# Altium project POWER CARD.PrjPcb
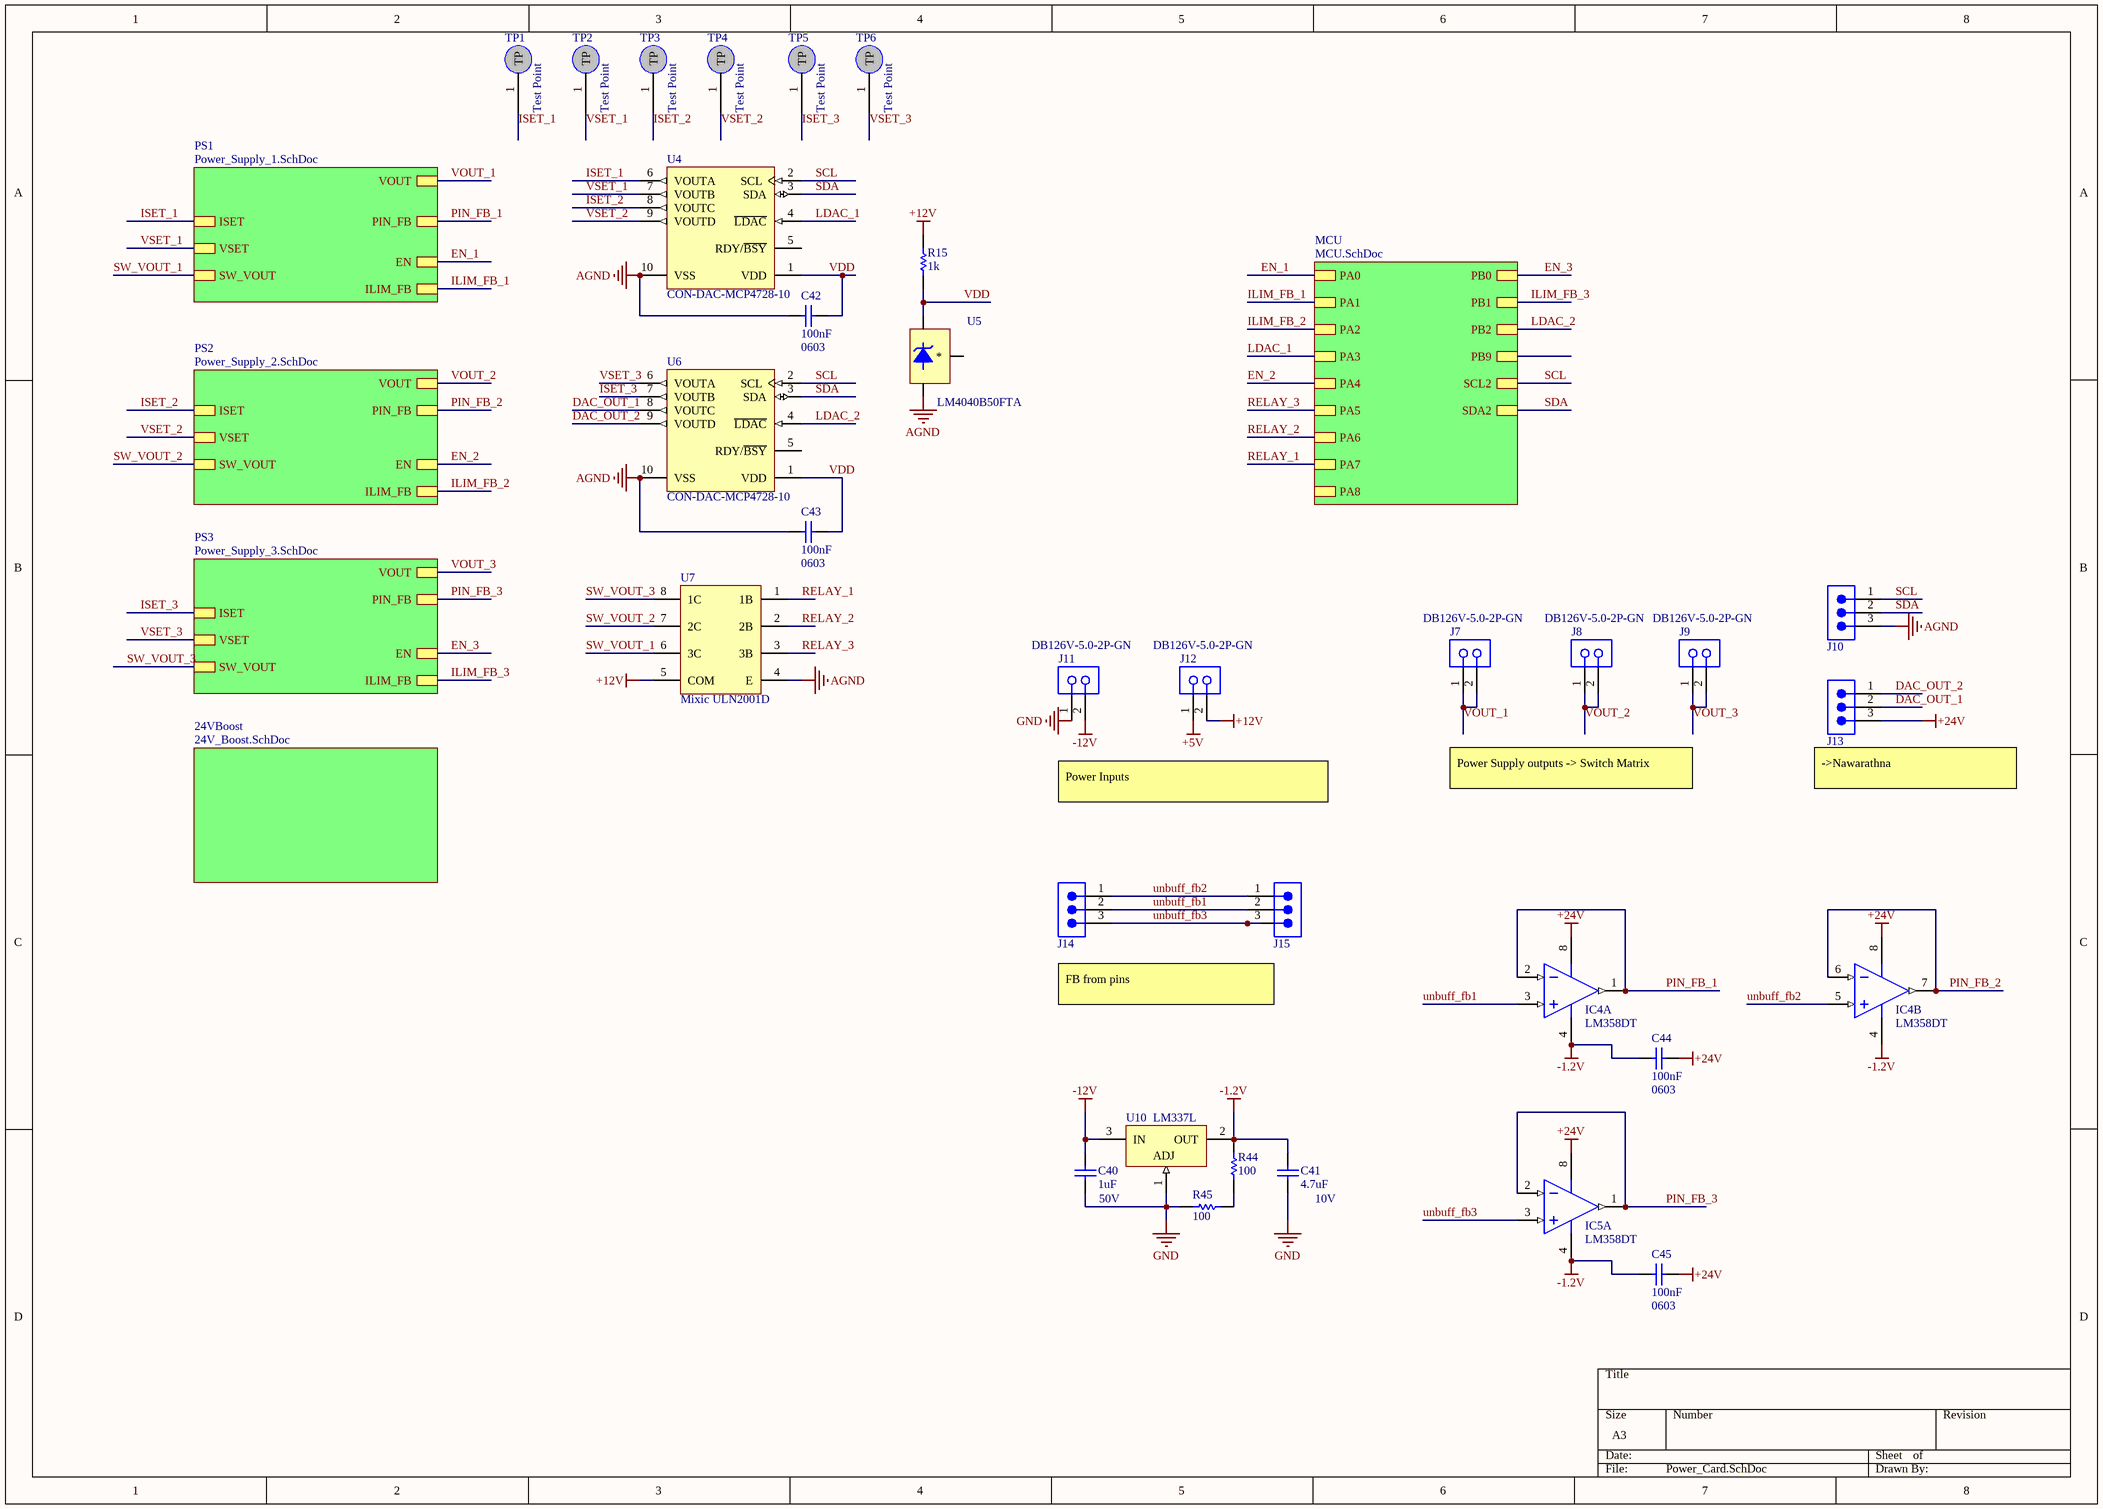
[diagram p0: Power_Card.SchDoc]
7 sheets, 178 parts. Net scope: hierarchical (ports join the sheet entries above them; power ports are global).
Board file: Power_Card_Lahiru.PcbDoc
Sheets:
  Power_Card.SchDoc
    PS1 = Power_Supply_1.SchDoc
      L1 = Power_Supply_Current_Limit.SchDoc
    PS2 = Power_Supply_2.SchDoc
      L2 = Power_Supply_Current_Limit.SchDoc
    PS3 = Power_Supply_3.SchDoc
      L3 = Power_Supply_Current_Limit.SchDoc
    24VBoost = 24V_Boost.SchDoc
    MCU = MCU.SchDoc

## Sheet Power_Card.SchDoc
size A3

### Parts
C40  1uF  Voltage-Rated: 50V  [CAPC1608X09N]
C41  4.7uF  Voltage-Rated: 10V  [CAPC1608X09N]
C42  100nF  Package / Case: 0603  [CAPC1608X09N]
C43  100nF  Package / Case: 0603  [CAPC1608X09N]
C44  100nF  Package / Case: 0603  [CAPC1608X09N]
C45  100nF  Package / Case: 0603  [CAPC1608X09N]
IC4  LM358DT  [SOIC-OA8_M]  (parts A,B of 2)
IC5  LM358DT  [SOIC-OA8_M]  (part A of 2)
J7  DB126V-5.0-2P-GN  [PCB-kiok1jlp9o9fcwf1wwvf-1]
J8  DB126V-5.0-2P-GN  [PCB-kiok1jlp9o9fcwf1wwvf-1]
J9  DB126V-5.0-2P-GN  [PCB-kiok1jlp9o9fcwf1wwvf-1]
J10  M20-9990346  [PIN_3x1_STR (2.54mm)]  (value not drawn)
J11  DB126V-5.0-2P-GN  [PCB-kiok1jlp9o9fcwf1wwvf-1]
J12  DB126V-5.0-2P-GN  [PCB-kiok1jlp9o9fcwf1wwvf-1]
J13  M20-9990346  [PIN_3x1_STR (2.54mm)]  (value not drawn)
J14  M20-9990346  [PIN_3x1_STR (2.54mm)]  (value not drawn)
J15  M20-9990346  [PIN_3x1_STR (2.54mm)]  (value not drawn)
R15  1k  [gen0603-2]
R44  100  [gen0603-2]
R45  100  [gen0603-2]
TP1  Test Point  [PCB-76sf9akqozhr8i1vmz2c-1]
TP2  Test Point  [PCB-76sf9akqozhr8i1vmz2c-1]
TP3  Test Point  [PCB-76sf9akqozhr8i1vmz2c-1]
TP4  Test Point  [PCB-76sf9akqozhr8i1vmz2c-1]
TP5  Test Point  [PCB-76sf9akqozhr8i1vmz2c-1]
TP6  Test Point  [PCB-76sf9akqozhr8i1vmz2c-1]
U4  CON-DAC-MCP4728-10  [PCB-psrfqusngns6snaz1e8o-1]
U5  LM4040B50FTA  [PCB-bxhnyzncanvi69437o7v-1]
U6  CON-DAC-MCP4728-10  [PCB-psrfqusngns6snaz1e8o-1]
U7  Mixic ULN2001D  [PCB-pxs93rufbf6wijgtyo7d-1]
U10  LM337L  [Z03A]

### Sub-sheets
24VBoost = 24V_Boost.SchDoc: no entries
MCU = MCU.SchDoc: PA1, PA8, PB2, PB9, PA7, PA6, PA4, PA2, PA5, PA3, SDA2, PB0, PB1, SCL2, PA0
PS1 = Power_Supply_1.SchDoc: EN, VSET, VOUT, ISET, SW_VOUT, ILIM_FB, PIN_FB
PS2 = Power_Supply_2.SchDoc: VSET, EN, SW_VOUT, VOUT, ISET, ILIM_FB, PIN_FB
PS3 = Power_Supply_3.SchDoc: VSET, EN, SW_VOUT, VOUT, ISET, ILIM_FB, PIN_FB

### Nets
+5V: J12.1
+12V: J12.2 R15.2 U7.5(COM)
+24V: C44.2 C45.2 IC4.8(VCC) IC5.8(VCC) J13.3
-1.2V: C41.2 C44.1 C45.1 IC4.4(VEE/GND) IC5.4(VEE/GND) R44.1 U10.2(OUT)
-12V: C40.2 J11.2 U10.3(IN)
AGND: C42.2 C43.1 J10.3 U4.10(VSS) U5.2(-V) U6.10(VSS) U7.4(E)
GND: C40.1 C41.1 J11.1 R45.2 U10.1(ADJ)
DAC_OUT_1: J13.2 U6.8(VOUTC)
DAC_OUT_2: J13.1 U6.9(VOUTD)
EN_1: sheet PS1/EN, sheet MCU/PA0
EN_2: sheet PS2/EN, sheet MCU/PA4
EN_3: sheet PS3/EN, sheet MCU/PB0
ILIM_FB_1: sheet PS1/ILIM_FB, sheet MCU/PA1
ILIM_FB_2: sheet PS2/ILIM_FB, sheet MCU/PA2
ILIM_FB_3: sheet PS3/ILIM_FB, sheet MCU/PB1
ISET_1: TP1.1(TP) U4.6(VOUTA) ; sheet PS1/ISET
ISET_2: TP3.1(TP) U4.8(VOUTC) ; sheet PS2/ISET
ISET_3: TP5.1(TP) U6.7(VOUTB) ; sheet PS3/ISET
LDAC_1: U4.4(~{LDAC}) ; sheet MCU/PA3
LDAC_2: U6.4(~{LDAC}) ; sheet MCU/PB2  [project net BOOT1]
PIN_FB_1: IC4.1(OUTA) IC4.2(INA-) ; sheet PS1/PIN_FB  [project net FB1]
PIN_FB_2: IC4.6(INB-) IC4.7(OUTB) ; sheet PS2/PIN_FB  [project net FB2]
PIN_FB_3: IC5.1(OUTA) IC5.2(INA-) ; sheet PS3/PIN_FB  [project net FB3]
RELAY_1: U7.1(1B) ; sheet MCU/PA7
RELAY_2: U7.2(2B) ; sheet MCU/PA6
RELAY_3: U7.3(3B) ; sheet MCU/PA5
SCL: J10.1 U4.2(SCL) U6.2(SCL) ; sheet MCU/SCL2  [project net PB10]
SDA: J10.2 U4.3(SDA) U6.3(SDA) ; sheet MCU/SDA2  [project net PB11]
SW_VOUT_1: U7.6(3C) ; sheet PS1/SW_VOUT
SW_VOUT_2: U7.7(2C) ; sheet PS2/SW_VOUT
SW_VOUT_3: U7.8(1C) ; sheet PS3/SW_VOUT
unbuff_fb1: IC4.3(INA+) J14.2 J15.2
unbuff_fb2: IC4.5(INB+) J14.1 J15.1
unbuff_fb3: IC5.3(INA+) J14.3 J15.3
VDD: C42.1 C43.2 R15.1 U4.1(VDD) U5.3(+V) U6.1(VDD)
VOUT_1: J7.1 J7.2 ; sheet PS1/VOUT  [project net VOUT1]
VOUT_2: J8.1 J8.2 ; sheet PS2/VOUT  [project net VOUT2]
VOUT_3: J9.1 J9.2 ; sheet PS3/VOUT  [project net VOUT3]
VSET_1: TP2.1(TP) U4.7(VOUTB) ; sheet PS1/VSET
VSET_2: TP4.1(TP) U4.9(VOUTD) ; sheet PS2/VSET
VSET_3: TP6.1(TP) U6.6(VOUTA) ; sheet PS3/VSET
NetR44_2: R44.2 R45.1

Not connected (* = marked no-connect by the designer): U4 5(RDY/~{BSY}); U5 1(*); U6 5(RDY/~{BSY})

### Notes on the sheet
- Power Supply outputs -> Switch Matrix
- (near J13) ->Nawarathna
- Power Inputs
- FB from pins

### Library data of the parts
C40 = CMP-2f55e5122ad9f092-5: 0603 10 nF 50 V ± 10% Tolerance X7R Surface Mount Multilayer Ceramic Capacitor; Manufacture Part Number: CL21B105KBFNNNE; Manufacturer: Samsung Electro-Mechanics; Capacitance: 1uF; Package / Case: 0603; Supplier: LCSC; Supplier Part Number: C28323; Capacitance Tolerance: 10%
C41 = CMP-2f55e5122ad9f092-5: 0603 10 nF 50 V ± 10% Tolerance X7R Surface Mount Multilayer Ceramic Capacitor; Manufacture Part Number: CL10A475KP8NNNC; Manufacturer: Samsung Electro-Mechanics; Capacitance: 4.7uF; Package / Case: 0603; Supplier: LCSC; Supplier Part Number: C1705; Capacitance Tolerance: 10%
C42-C45 = CMP-2f55e5122ad9f092-5: 0603 10 nF 50 V ± 10% Tolerance X7R Surface Mount Multilayer Ceramic Capacitor; Manufacture Part Number: CC0603KRX7R9BB104; Manufacturer: YAGEO; Voltage-Rated: 50V; Capacitance Tolerance: 10%; Capacitance: 100nF; Supplier: LCSC; Supplier Part Number: C14663
IC4 IC5 = CMP-9a3c516d515145fb-3: LM358 Series 30 V 1.1 MHz Low Power Dual Operational Amplifier - SOIC-8; Manufacturer: STMicroelectronics; Slew Rate: 600 mV/μs; Number of Channels: 2; Gain Bandwidth Product: 1.10 MHz; Supply Current: 700 µA; Lead-Free Status: Lead Free; Supply Voltage (DC): 32.0 V; Lifecycle Status: Active; REACH SVHC Compliance: No SVHC; Octopart URL: https://octopart.com/lm358dt-stmicroelectronics-39579147; RoHS: Compliant; Number of Pins: 8; Bandwidth: 1.10 MHz; Number of Circuits: 2; Packaging: Cut Tape (CT), Tape & Reel (TR); Mounting Style: Surface Mount; Case/Package: SOIC; OctopartID: 9a3c516d515145fb; Manufacture Part Number: LM358DT; Supplier: LCSC; Supplier Part Number: C9418
J7-J9 J11 J12 = CMP-7ad9b3d37ed8a51e-5: Block, Terminal; 13.5 A; 250 V; 5 mm; 26 to 16 AWG; 2; Screw; Solder; 4 kV; PA; Manufacturer: DIBO; Pin pitch: 5.0mm; Manufacture Part Number: DB126V-5.0-2P-GN; Supplier: LCSC; Supplier Part Number: C395849
J10 J13-J15 = CMP-1d18d4412a33c2df-10: HARWIN M20 Series, 2.54mm Pitch 3 Way 1 Row Straight PCB Header, Solder Termination, 3A
R15 = CMP-1853278-27_16: Surface Mount Thick Film Resistor, RC Series, 1 kohm, 100 mW, - 1%, 50 V, 0603 [1608 Metric]; Manufacturer: YAGEO; Manufacture Part Number: RC0603FR-071KL; Package / Case: 0603; Resistance: 1k; Resistance Tolerance: 1%; Supplier: LCSC; Supplier Part Number: C22548
R44 R45 = CMP-1853278-27: Surface Mount Thick Film Resistor, RC Series, 1 kohm, 100 mW, - 1%, 50 V, 0603 [1608 Metric]; Manufacturer: UNI-ROYAL(Uniroyal Elec); Manufacture Part Number: 0603WAF1000T5E; Resistance Tolerance: 1%; Supplier: LCSC; Supplier Part Number: C22775; Resistance: 100; Package / Case: 0603
TP1-TP6 = CMP-90rr9i2gqvuy4eydob4k-1: TP; CustomComponentID: 90rr9i2gqvuy4eydob4k
U4 U6 = CMP-2294796-6: MCP4728 Series 4 Ch I2C EEPROM Memory 5.5 V 12-Bit D/A Converter SMT - MSOP-10; Manufacture Part Number: MCP4728-E/UN; Manufacturer: Microchip Tech; Supply Current: 800 µA; Number of Bits: 12; Octopart URL: http://octopart.com/mcp4728-e%2Fun-microchip-11800165; OctopartID: b4d07d6e9fd36b17; Mounting Style: Surface Mount; Lifecycle Status: Active; Number of Pins: 10; RoHS: Compliant; REACH SVHC Compliance: No SVHC; Supplier: LCSC; Supplier Part Number: C108207
U5 = CMP-ed9925821aa6325e-1: LM4040 Series 5 V ±0.2 % Precision Micropower Shunt Voltage Reference - SOT-23; Manufacturer: Diodes Incorporated; Temperature Coefficient: 20.0 ppm/°C; Supplier: LCSC; Supplier Part Number: C460606; Manufacture Part Number: LM4040B50FTA
U7 = CMP-uwgrh96kdeedshkgggct-4: Darlington transistor array driver; CustomComponentID: uwgrh96kdeedshkgggct; Manufacturer: Mixic; Manufacture Part Number: ULN2001D; Supplier: LCSC; Supplier Part Number: C108905
U10 = LM337LZ/NOPB: 3-Terminal Adjustable Regulator, 3-pin TO-92, Pb-Free; Manufacturer: Texas Instruments; Current Rating: 1.0 A; Dropout Voltage: 0.003 V; Lead-Free Status: Lead Free; Number of Outputs: 1; Output Current: 0.1 A; Case/Package: SOIC; Lifecycle Status: Active; Mounting Style: Through Hole; Number of Pins: 3; Number of Regulated Outputs: 1; Octopart Url: https://octopart.com/lm337lz%2Fnopb-texas+instruments-24813737; OctopartID: cd28055848e712ef; Packaging: Box; REACH SVHC Compliance: No SVHC; RoHS: Compliant; Manufacture Part Number: LM337LZ/NOPB; Supplier: LCSC; Supplier Part Number: C33082

## Sheet Power_Supply_1.SchDoc
size A4
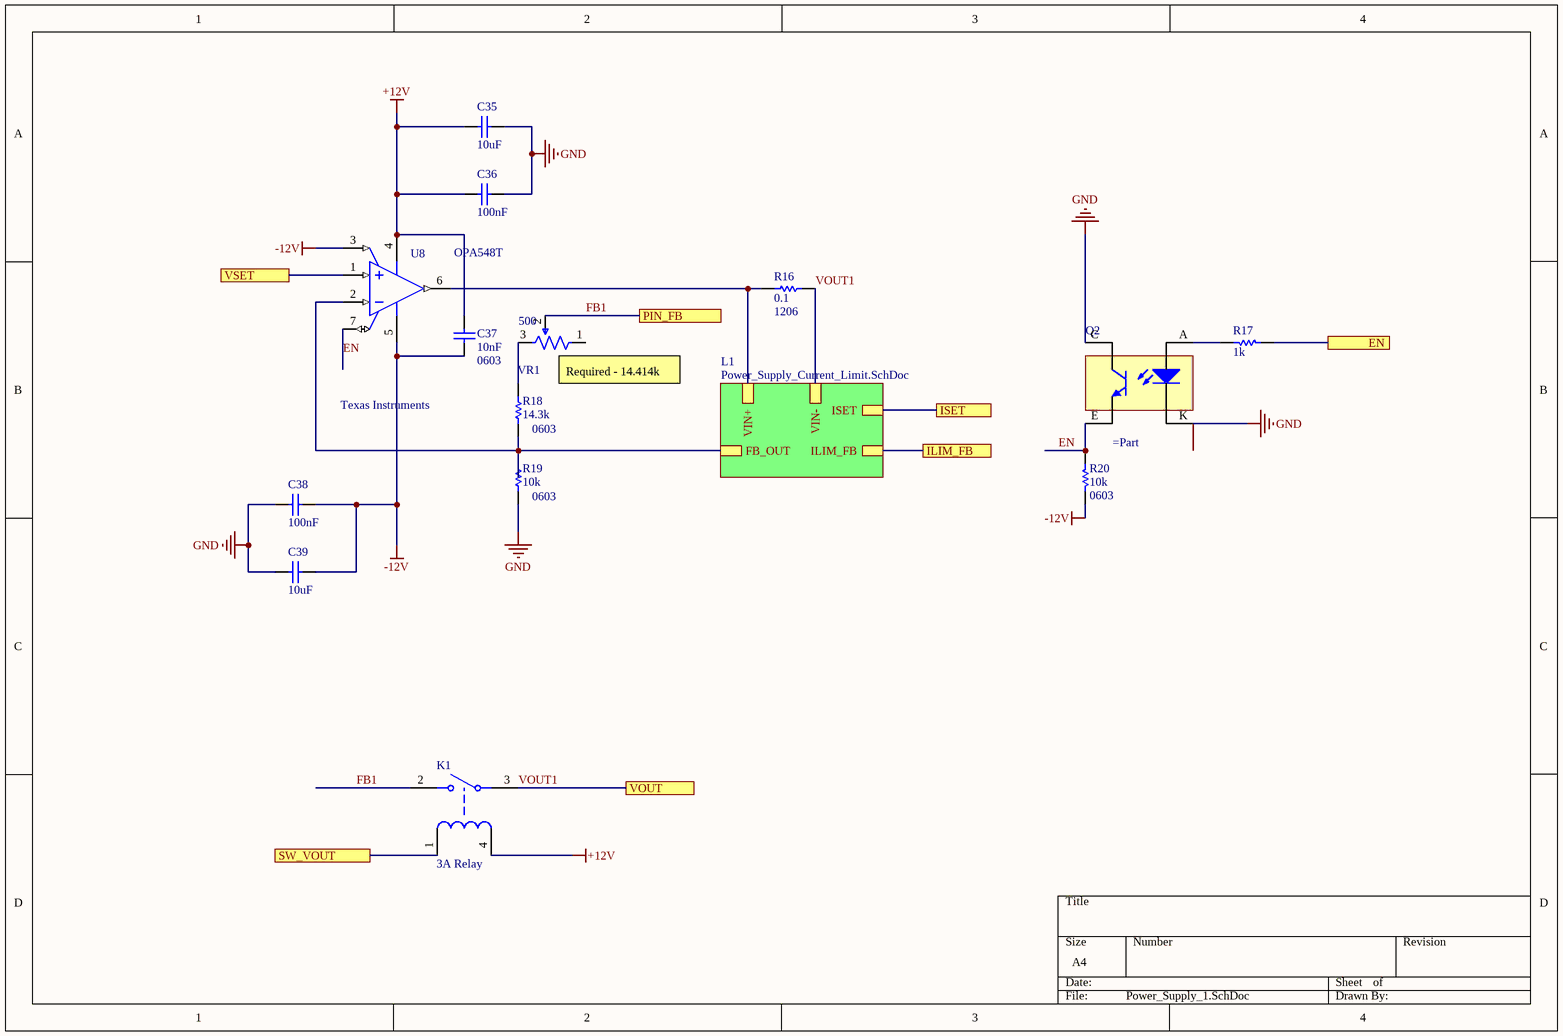
[diagram p1: Power_Supply_1.SchDoc]

### Parts
C35  10uF  [CAPC3216X127X50ML20T25]
C36  100nF  [CAPC1608X09N]
C37  10nF  Package / Case: 0603  [CAPC1608X09N]
C38  100nF  [CAPC1608X09N]
C39  10uF  [CAPC3216X127X50ML20T25]
K1  3A Relay  [PCB-ei6nokn2irsc2a7yt94x-1]
Q2  (no value)  [PCB-tryrgihdrozpg2dv6q87-1]
R16  0.1  Package / Case: 1206  [RESC3116X07M]
R17  1k  [gen0603-2]
R18  14.3k  Package / Case: 0603  [gen0603-2]
R19  10k  Package / Case: 0603  [gen0603-2]
R20  10k  Package / Case: 0603  [gen0603-2]
U8  OPA548T  Manufacturer: Texas Instruments  [TI-KVT7]
VR1  500  [PCB-8uuv2uwn1geg2g5qqyha-1]

### Sub-sheets
L1 = Power_Supply_Current_Limit.SchDoc: VIN-, FB_OUT, VIN+, ILIM_FB, ISET

### Ports
EN, ILIM_FB, ISET, PIN_FB, SW_VOUT, VOUT, VSET

### Nets
+12V: C35.2 C36.2 C37.2 K1.4 U8.4(V-)
-12V: C37.1 C38.2 C39.2 R20.1 U8.3(ILIM) U8.5(V+)
GND: C35.1 C36.1 C38.1 C39.1 Q2.C Q2.K R19.1
EN: Q2.E R20.2 U8.7(E/S)
EN_1: R17.2 ; port EN
FB1: K1.2 VR1.2(CW) ; port PIN_FB
ILIM_FB_1: port ILIM_FB, sheet L1/ILIM_FB
ISET_1: port ISET, sheet L1/ISET
SW_VOUT_1: K1.1 ; port SW_VOUT
VOUT1: K1.3 R16.1 ; port VOUT, sheet L1/VIN-
VSET_1: U8.1(VIN+) ; port VSET
NetC33_L1_2: R18.1 R19.2 U8.2(VIN-) ; sheet L1/FB_OUT
NetQ2_A: Q2.A R17.1
NetQ3_L1_3: R16.2 U8.6(VO) ; sheet L1/VIN+
NetR18_2: R18.2 VR1.3(CW)

Not connected (* = marked no-connect by the designer): VR1 1(CCW)

### Notes on the sheet
- (near VR1) Required - 14.414k

### Library data of the parts
C35 C39 = CMP-126371-4: CAP CER 0.1UF 100V 10% X7R 1206; Manufacturer: Samsung Electro-Mechanics; Manufacture Part Number: CL31B106KBHNNNE; Voltage-Rated: 50V; Supplier: LCSC; Capacitance: 10uF; Package / Case: 1206; Capacitance Tolerance: 10%; Supplier Part Number: C89632
C36 C38 = CMP-2f55e5122ad9f092-5: as C42 on sheet Power_Card; Capacitance Tolerance: 10%; Capacitance: 100nF; Package / Case: 0603; Supplier: LCSC; Supplier Part Number: C14663
C37 = CMP-2f55e5122ad9f092-5: 0603 10 nF 50 V ± 10% Tolerance X7R Surface Mount Multilayer Ceramic Capacitor; Manufacture Part Number: CL10B103KC8NNNC; Manufacturer: Samsung Electro-Mechanics; Voltage-Rated: 100V; Capacitance Tolerance: 10%; Capacitance: 10nF; Supplier: LCSC; Supplier Part Number: C84709
K1 = CMP-edc624afa9603201-3: Power Relay 12VDC 3DC/5AAC SPST-NO( (20.5mm 7.2mm 15.3mm)) THT; Manufacturer: Omron Electronics; Manufacture Part Number: G5NB-1A-E-DC12; Supplier: LCSC; Supplier Part Number: C225714; Current-Rated: 3A
Q2 = CMP-20cdecc1b9d8ff0a-1: Optocoupler DC-IN 1-CH Transistor DC-OUT 4-Pin PDIP SMD Black Box; Manufacturer: TOSHIBA; Manufacture Part Number: TLP785(GB-TP6,F(C; Supplier: LCSC; Supplier Part Number: C45445
R16 = CMP-90ca5a8d69034f0d-5: Res Thick Film 3.2 x 1.6 mm 10K Ohm 1% 0.25W(1/4W) 100ppm/ C Molded SMD Paper T/R; Manufacture Part Number: 1206W4F100LT5E; Manufacturer: UNI-ROYAL(Uniroyal Elec); Resistance: 0.1; Resistance Tolerance: 1%; Supplier: LCSC; Supplier Part Number: C25334
R17 = CMP-1853278-27_13: Surface Mount Thick Film Resistor, RC Series, 1 kohm, 100 mW, - 1%, 50 V, 0603 [1608 Metric]; Manufacturer: YAGEO; Manufacture Part Number: RC0603FR-071KL; Resistance Tolerance: 1%; Supplier: LCSC; Supplier Part Number: C22548; Resistance: 1k; Package / Case: 0603
R18 = CMP-1853278-27: Surface Mount Thick Film Resistor, RC Series, 1 kohm, 100 mW, - 1%, 50 V, 0603 [1608 Metric]; Manufacturer: UNI-ROYAL(Uniroyal Elec); Manufacture Part Number: 0603WAF1432T5E; Resistance Tolerance: 1%; Supplier: LCSC; Supplier Part Number: C22799; Resistance: 14.3k
R19 R20 = CMP-1853278-27: Surface Mount Thick Film Resistor, RC Series, 1 kohm, 100 mW, - 1%, 50 V, 0603 [1608 Metric]; Manufacturer: YAGEO; Manufacture Part Number: RC0603FR-0710KL; Resistance Tolerance: 1%; Supplier: LCSC; Supplier Part Number: C98220; Resistance: 10k
U8 = CMP-13615009-4: High-Voltage, High-Current Operational Amplifier, Excellent Output Swing, 8 to 60 V, -40 to 85 degC, 7-pin FM (KVT7), Green (RoHS & no Sb/Br); Bandwidth: 1000000.0 Hz; Input Offset Drift: 3e-05 V/K; Lead-Free Status: Lead Free; Number of Channels: 1; Slew Rate: 10.0 V/μs; Supply Voltage (DC): 60.0 V; Gain Bandwidth Product: 1000000.0 Hz; Lifecycle Status: Active; Mounting Style: Through Hole; Number of Circuits: 1; Number of Pins: 7; Octopart Url: https://octopart.com/opa548t-texas+instruments-420784; OctopartID: 076ece6249b8d8a9; Packaging: Bulk; REACH SVHC Compliance: No SVHC; RoHS: Compliant; Manufacture Part Number: OPA548T; Supplier Part Number: C138712; Supplier: LCSC
VR1 = CMP-7537bc3cde65aaf0-3: Trimmer; Cermet; Rest 500 Ohms; PCB; 25 Turns; Pwr-Rtg 0.5W; Manufacture Part Number: 3296W-1-501; Manufacturer: BOCHEN(Chengdu Guosheng Tech); Voltage Rating (DC) 300v: 300 V; Temperature Coefficient: -100 ppm/°C to 100 ppm/°C; Supplier: LCSC; Supplier Part Number: C118913; Resistance: 500

## Sheet Power_Supply_Current_Limit.SchDoc
size A4
Used 3 times, as channels PS1/L1, PS2/L2, PS3/L3. Parts and nets are listed once, with the designators drawn on the sheet.
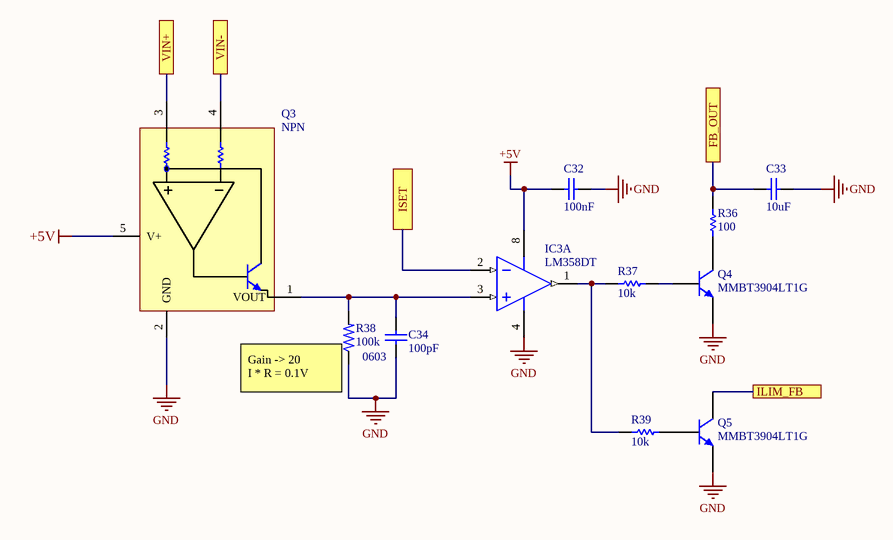
[diagram p2: Power_Supply_Current_Limit.SchDoc]

### Parts
C32  100nF  [CAPC1608X09N]
C33  10uF  [CAPC3216X127X50ML20T25]
C34  100pF  [CAPC1608X09N]
IC3  LM358DT  [SOIC-OA8_M]  (part A of 2)
Q3  NPN  [PCB-h3r3bzz71pyabhalkrge-1]
Q4  MMBT3904LT1G  [SOT-23]
Q5  MMBT3904LT1G  [SOT-23]
R36  100  [gen0603-2]
R37  10k  [gen0603-2]
R38  100k  Package / Case: 0603  [PCB-3elf45qdqizoabmczrxc-1]
R39  10k  [gen0603-2]

### Ports
FB_OUT, ILIM_FB, ISET, VIN+, VIN-

### Nets
+5V: C32.2 IC3.8(VCC) Q3.5(V+)
GND: C32.1 C33.1 C34.1 IC3.4(VEE/GND) Q3.2(GND) Q4.2(E) Q5.2(E) R38.1
FB_OUT: C33.2 R36.2 ; port FB_OUT
ILIM_FB: Q5.3(C) ; port ILIM_FB
ISET: IC3.2(INA-) ; port ISET
VIN+: Q3.3 ; port VIN+
VIN-: Q3.4 ; port VIN-
NetC34_2: C34.2 IC3.3(INA+) Q3.1(VOUT) R38.2
NetIC3_1: IC3.1(OUTA) R37.2 R39.2
NetQ4_1: Q4.1(B) R37.1
NetQ5_1: Q5.1(B) R39.1

Not connected (* = marked no-connect by the designer): Q4 3(C); R36 1

### Channels
PS1/L1: designators end in _L1; ports FB_OUT=NetC33_L1_2 ILIM_FB=ILIM_FB_1 ISET=ISET_1 VIN+=NetQ3_L1_3 VIN-=VOUT1
PS2/L2: designators end in _L2; ports FB_OUT=NetC21_1 ILIM_FB=ILIM_FB_2 ISET=ISET_2 VIN+=NetC21_2 VIN-=VOUT2
PS3/L3: designators end in _L3; ports FB_OUT=NetC29_1 ILIM_FB=ILIM_FB_3 ISET=ISET_3 VIN+=NetC28_2 VIN-=VOUT3

### Notes on the sheet
- (near R38) Gain -> 20
  I * R = 0.1V

### Library data of the parts
C32 = CMP-2f55e5122ad9f092-5: as C42 on sheet Power_Card; Capacitance Tolerance: 10%; Capacitance: 100nF; Package / Case: 0603; Supplier: LCSC; Supplier Part Number: C14663
C33 = CMP-126371-4: as C35 on sheet Power_Supply_1; Supplier: LCSC; Capacitance: 10uF; Package / Case: 1206; Capacitance Tolerance: 10%; Supplier Part Number: C89632
C34 = CMP-2f55e5122ad9f092-5: 0603 10 nF 50 V ± 10% Tolerance X7R Surface Mount Multilayer Ceramic Capacitor; Manufacture Part Number: 0603N101J500CT; Manufacturer: Walsin Tech Corp; Capacitance Tolerance: 5%; Voltage-Rated: 50V; Capacitance: 100pF; Package / Case: 0603; Supplier: LCSC; Supplier Part Number: C335544
IC3 = CMP-9a3c516d515145fb-3: as IC4 on sheet Power_Card; Lifecycle Status: Active; REACH SVHC Compliance: No SVHC; Octopart URL: https://octopart.com/lm358dt-stmicroelectronics-39579147; RoHS: Compliant; Number of Pins: 8; Bandwidth: 1.10 MHz; Number of Circuits: 2; Packaging: Cut Tape (CT), Tape & Reel (TR); Mounting Style: Surface Mount; Case/Package: SOIC; OctopartID: 9a3c516d515145fb; Manufacture Part Number: LM358DT; Supplier: LCSC; Supplier Part Number: C9418
Q3 = CMP-0019c915bbf2dfde-3: 36-V, High-Side, Current Output Current Shunt Monitor 5-SOT-23 -40 to 125; Manufacture Part Number: INA138NA/3K; Manufacturer: Texas Instruments; Case/Package: SOT-23; Supplier: LCSC; Supplier Part Number: C47914
Q4 Q5 = CMP-857799-8: MMBT Series 40 V 200 mA SMT NPN Silicon General Purpose Transistor - SOT-23; Manufacturer: ON Semiconductor; Supplier Part Number: C81464; Supplier: LCSC; Manufacture Part Number: MMBT3904LT1G
R36 = CMP-1853278-27: as R44 on sheet Power_Card; Resistance Tolerance: 1%; Supplier: LCSC; Supplier Part Number: C22775; Resistance: 100; Package / Case: 0603
R37 R39 = CMP-1853278-27: as R19 on sheet Power_Supply_1; Resistance Tolerance: 1%; Supplier: LCSC; Supplier Part Number: C98220; Resistance: 10k; Package / Case: 0603
R38 = CMP-1853278-23: Surface Mount Thick Film Resistor, RC Series, 1 kohm, 100 mW, - 1%, 50 V, 0603 [1608 Metric]; Manufacturer: Walsin Tech Corp; Manufacture Part Number: WR06X1003FTL; Resistance Tolerance: 1%; Resistance: 100k; Supplier: LCSC; Supplier Part Number: C132374

## Sheet Power_Supply_2.SchDoc
size A4
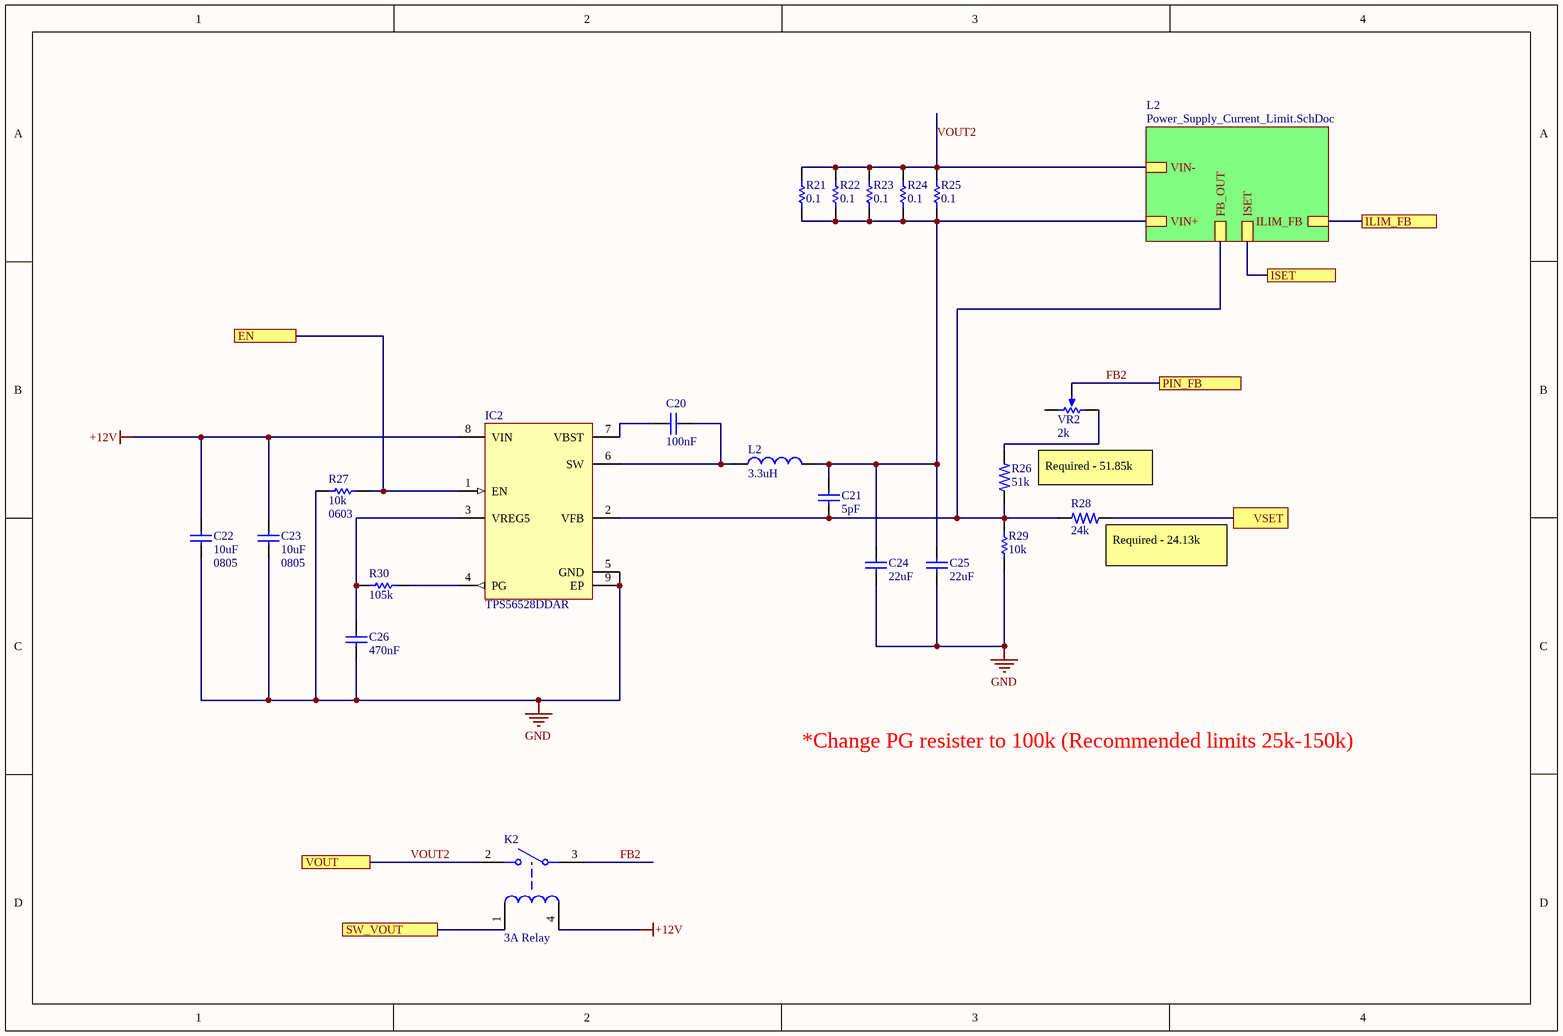
[diagram p3: Power_Supply_2.SchDoc]

### Parts
C20  100nF  [CAPC1608X09N]
C21  5pF  [CAPC1608X09N]
C22  10uF  Package / Case: 0805  [C0805]
C23  10uF  Package / Case: 0805  [C0805]
C24  22uF  [CAPC1608X09N]
C25  22uF  [CAPC1608X09N]
C26  470nF  [CAPC1608X09N]
IC2  TPS56528DDAR  [PCB-duyb6heo4lj5grkfxin6-1]
K2  3A Relay  [PCB-ei6nokn2irsc2a7yt94x-1]
L2  3.3uH  [PCB-grsryisdn8451x3s484y-1]
R21  0.1  [RESC3116X07M]
R22  0.1  [RESC3116X07M]
R23  0.1  [RESC3116X07M]
R24  0.1  [RESC3116X07M]
R25  0.1  [RESC3116X07M]
R26  51k  [PCB-3elf45qdqizoabmczrxc-1]
R27  10k  Package / Case: 0603  [gen0603-2]
R28  24k  [PCB-3elf45qdqizoabmczrxc-1]
R29  10k  [gen0603-2]
R30  105k  [gen0603-2]
VR2  2k  [PCB-5abvnr99iwiiosfurk6j-1]

### Sub-sheets
L2 = Power_Supply_Current_Limit.SchDoc: VIN-, FB_OUT, VIN+, ISET, ILIM_FB

### Ports
EN, ILIM_FB, ISET, PIN_FB, SW_VOUT, VOUT, VSET

### Nets
+12V: C22.2 C23.2 IC2.8(VIN) K2.4
GND: C22.1 C23.1 C24.1 C25.1 C26.1 IC2.5(GND) IC2.9(EP) R27.2 R29.1
EN_2: IC2.1(EN) R27.1 ; port EN
FB2: K2.3 VR2.2(WIPER) ; port PIN_FB
ILIM_FB_2: port ILIM_FB, sheet L2/ILIM_FB
ISET_2: port ISET, sheet L2/ISET
SW_VOUT_2: K2.1 ; port SW_VOUT
VOUT2: K2.2 R21.1 R22.2 R23.2 R24.2 R25.2 ; port VOUT, sheet L2/VIN-
VSET_2: R28.1 ; port VSET
NetC20_1: C20.1 IC2.6(SW) L2.1
NetC20_2: C20.2 IC2.7(VBST)
NetC21_1: C21.1 IC2.2(VFB) R26.1 R28.2 R29.2 ; sheet L2/FB_OUT
NetC21_2: C21.2 C24.2 C25.2 L2.2 R21.2 R22.1 R23.1 R24.1 R25.1 ; sheet L2/VIN+
NetC26_2: C26.2 IC2.3(VREG5) R30.2
NetIC2_4: IC2.4(PG) R30.1
NetR26_2: R26.2 VR2.3(CW)

Not connected (* = marked no-connect by the designer): VR2 1(CCW)

### Notes on the sheet
- Required - 51.85k
- (near R28) Required - 24.13k
- *Change PG resister to 100k (Recommended limits 25k-150k)

### Library data of the parts
C20 = CMP-2f55e5122ad9f092-5: as C42 on sheet Power_Card; Capacitance Tolerance: 10%; Capacitance: 100nF; Package / Case: 0603; Supplier: LCSC; Supplier Part Number: C14663
C21 = CMP-2f55e5122ad9f092-5: 0603 10 nF 50 V ± 10% Tolerance X7R Surface Mount Multilayer Ceramic Capacitor; Manufacture Part Number: CL10C050CB8NNNC; Manufacturer: Samsung Electro-Mechanics; Capacitance Tolerance: 0.25%; Voltage-Rated: 50V; Capacitance: 5pF; Package / Case: 0603; Supplier: LCSC; Supplier Part Number: C93045
C22 C23 = CMP-135114-3: Cap Ceramic 0.1uF 50V X7R 10% SMD 0805 125C Embossed T/R; Manufacture Part Number: CL21B106KOQNNNE; Manufacturer: Samsung Electro-Mechanics; Voltage-Rated: 16V; Capacitance Tolerance: *; Capacitance: 10uF; Supplier: LCSC; Supplier Part Number: C95841
C24 C25 = CMP-2f55e5122ad9f092-5: 0603 10 nF 50 V ± 10% Tolerance X7R Surface Mount Multilayer Ceramic Capacitor; Manufacture Part Number: CL10A226MP8NUNE; Manufacturer: Samsung Electro-Mechanics; Capacitance Tolerance: 20%; Voltage-Rated: 10V; Capacitance: 22uF; Package / Case: 0603; Supplier: LCSC; Supplier Part Number: C86295
C26 = CMP-2f55e5122ad9f092-5: 0603 10 nF 50 V ± 10% Tolerance X7R Surface Mount Multilayer Ceramic Capacitor; Manufacture Part Number: CL10F474ZO8NNNC; Manufacturer: Samsung Electro-Mechanics; Voltage-Rated: 16V; Capacitance Tolerance: 10%; Capacitance: 470nF; Package / Case: 0603; Supplier: LCSC; Supplier Part Number: C318652
IC2 = CMP-073acf9bf38cd8fd-4: 4.5V to 18V Input, 5-A Synchronous Step-Down Converter with Advanced Eco-mode™ 8-SO PowerPAD -40 to 125; Manufacturer: Texas Instruments; Topology: Buck; Number of Regulated Outputs: 1; RoHS: Compliant; Manufacture Part Number: TPS56528DDAR; Supplier: LCSC; Supplier Part Number: C138716
K2 = CMP-edc624afa9603201-3: as K1 on sheet Power_Supply_1; Supplier: LCSC; Supplier Part Number: C225714; Current-Rated: 3A
L2 = CMP-nvsrvemexzuzshl0ucuq-1: 3.3uH ±20% 10A 11.8m? Power Inductors; Manufacturer: SXN; Manufacture Part Number: SMMS1040-3R3M; Supplier: LCSC; Supplier Part Number: C149592; Inductance: 3.3uH; Rated Current: 10A
R21-R25 = CMP-90ca5a8d69034f0d-5: as R16 on sheet Power_Supply_1; Package / Case: 1206; Resistance: 0.1; Resistance Tolerance: 1%; Supplier: LCSC; Supplier Part Number: C25334
R26 = CMP-1853278-23: Surface Mount Thick Film Resistor, RC Series, 1 kohm, 100 mW, - 1%, 50 V, 0603 [1608 Metric]; Manufacturer: Walsin Tech Group; Manufacture Part Number: WR06X513 JTL; Resistance Tolerance: 1%; Package / Case: 0603; Resistance: 51k; Supplier: LCSC; Supplier Part Number: C384211
R27 R29 = CMP-1853278-27: as R19 on sheet Power_Supply_1; Resistance Tolerance: 1%; Supplier: LCSC; Supplier Part Number: C98220; Resistance: 10k
  R29: Package / Case: 0603
R28 = CMP-1853278-23: Surface Mount Thick Film Resistor, RC Series, 1 kohm, 100 mW, - 1%, 50 V, 0603 [1608 Metric]; Manufacturer: UNI-ROYAL(Uniroyal Elec); Manufacture Part Number: 0603WAJ0243T5E; Resistance Tolerance: 1%; Package / Case: 0603; Resistance: 24k; Supplier: LCSC; Supplier Part Number: C25588
R30 = CMP-1853278-27: Surface Mount Thick Film Resistor, RC Series, 1 kohm, 100 mW, - 1%, 50 V, 0603 [1608 Metric]; Manufacturer: UNI-ROYAL; Manufacture Part Number: 0603WAF1053T5E; Resistance Tolerance: 1%; Supplier: LCSC; Supplier Part Number: C16840; Resistance: 105k; Package / Case: 0603
VR2 = CMP-a8df61d7bf077718-3: Res Cermet Trimmer 2K Ohm 10% 1/2W 25(Elec)Turn 2.19mm (9.53 X 4.83 X 11.55mm) Pin Thru-Hole Tube; Manufacture Part Number: 3296W-1-202; Manufacturer: BOCHEN(Chengdu Guosheng Tech); Power Rating: 500 mW; Size-Height: 10.0 mm; Supplier Part Number: C118206; Supplier: LCSC; Resistance: 2k

## Sheet Power_Supply_3.SchDoc
size A4
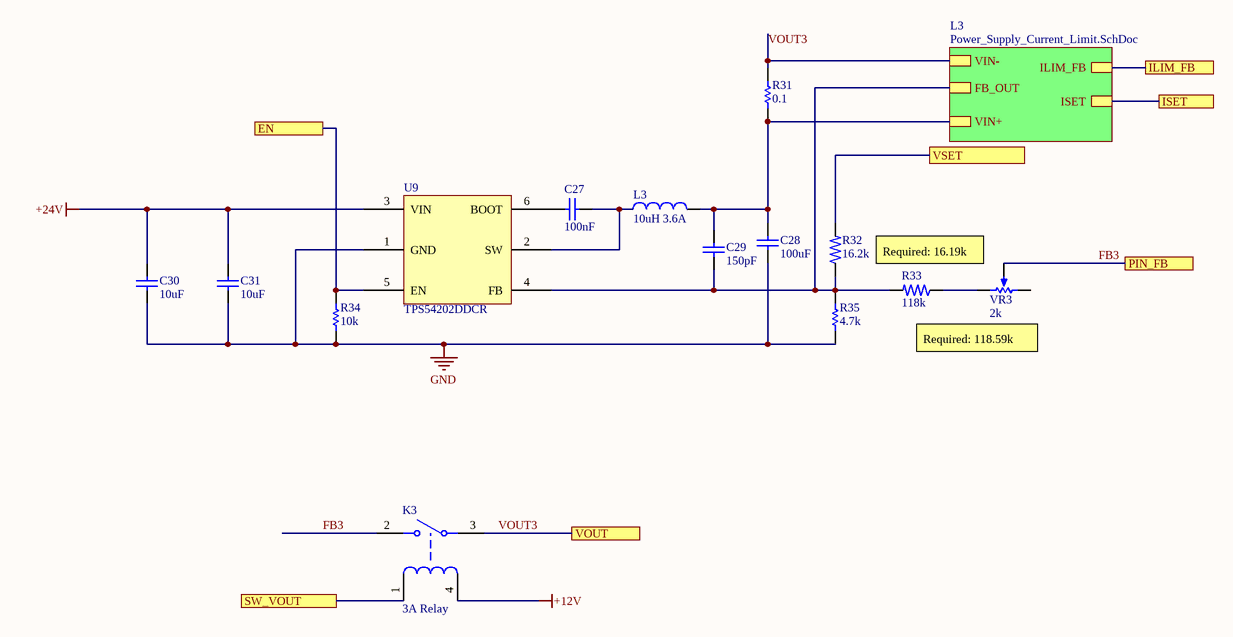
[diagram p4: Power_Supply_3.SchDoc]

### Parts
C27  100nF  [CAPC1608X09N]
C28  100uF  [PCB-qvt8zv9h5ffid452gs9x-1]
C29  150pF  [C0805]
C30  10uF  [CAPC3216X127X50ML20T25]
C31  10uF  [CAPC3216X127X50ML20T25]
K3  3A Relay  [PCB-ei6nokn2irsc2a7yt94x-1]
L3  10uH 3.6A  [PCB-aqghgth2fl3irtnr7nhi-1]
R31  0.1  [RESC3116X07M]
R32  16.2k  [PCB-3elf45qdqizoabmczrxc-1]
R33  118k  [PCB-3elf45qdqizoabmczrxc-1]
R34  10k  [gen0603-2]
R35  4.7k  [gen0603-2]
U9  TPS54202DDCR  [PCB-3e3nvufahczdahdcyxrk-1]
VR3  2k  [PCB-5abvnr99iwiiosfurk6j-1]

### Sub-sheets
L3 = Power_Supply_Current_Limit.SchDoc: VIN+, VIN-, ISET, FB_OUT, ILIM_FB

### Ports
EN, ILIM_FB, ISET, PIN_FB, SW_VOUT, VOUT, VSET

### Nets
+12V: K3.4
+24V: C30.2 C31.2 U9.3(VIN)
GND: C28.1 C30.1 C31.1 R34.2 R35.1 U9.1(GND)
EN_3: R34.1 U9.5(EN) ; port EN
FB3: K3.2 VR3.2(WIPER) ; port PIN_FB
ILIM_FB_3: port ILIM_FB, sheet L3/ILIM_FB
ISET_3: port ISET, sheet L3/ISET
SW_VOUT_3: K3.1 ; port SW_VOUT
VOUT3: K3.3 R31.1 ; port VOUT, sheet L3/VIN-
VSET_3: R32.2 ; port VSET
NetC27_1: C27.1 L3.1 U9.2(SW)
NetC27_2: C27.2 U9.6(BOOT)
NetC28_2: C28.2 C29.2 L3.2 R31.2 ; sheet L3/VIN+
NetC29_1: C29.1 R32.1 R33.2 R35.2 U9.4(FB) ; sheet L3/FB_OUT
NetR33_1: R33.1 VR3.1(CCW)

Not connected (* = marked no-connect by the designer): VR3 3(CW)

### Notes on the sheet
- (near VR3) Required: 16.19k
- Required: 118.59k

### Library data of the parts
C27 = CMP-2f55e5122ad9f092-5: as C42 on sheet Power_Card; Capacitance Tolerance: 10%; Capacitance: 100nF; Package / Case: 0603; Supplier: LCSC; Supplier Part Number: C14663
C28 = CMP-37c1fb270af2e806-1: Footprint for Rubycon 50YXF100MFFC8X11.5; Capacitance Tolerance: 20%; Voltage Rated: 50V; Manufacture Part Number: 50YXF100MFFC8X11.5; Capacitance: 100uF; Manufacturer: Rubycon; Package / Case: *; Supplier: LCSC; Supplier Part Number: C324036
C29 = CMP-135114-3: Cap Ceramic 0.1uF 50V X7R 10% SMD 0805 125C Embossed T/R; Manufacture Part Number: CC0805JRNPO9BN151; Manufacturer: YAGEO; Capacitance Tolerance: 5%; Package / Case: 0805; Capacitance: 150pF; Supplier: LCSC; Supplier Part Number: C107111; Voltage-Rated: 50V
C30 = CMP-126371-4: as C35 on sheet Power_Supply_1; Supplier: LCSC; Capacitance: 10uF; Package / Case: 1206; Capacitance Tolerance: 10%; Supplier Part Number: C89632
C31 = CMP-126371-4: CAP CER 0.1UF 100V 10% X7R 1206; Manufacture Part Number: CL31B106KBHNNNE; Manufacturer: Samsung Electro-Mechanics; Voltage-Rated: 50V; Supplier: LCSC; Capacitance: 10uF; Package / Case: 1206; Capacitance Tolerance: 10%; Supplier Part Number: C89632
K3 = CMP-edc624afa9603201-3: as K1 on sheet Power_Supply_1; Supplier: LCSC; Supplier Part Number: C225714; Current-Rated: 3A
L3 = CMP-8deb4183ed4a522c-1: Inductor Power Shielded Wirewound 10uH 20% 100KHz Metal 4.2A 86.35mOhm DCR Automotive T/R; Manufacture Part Number: SPM6530T-100M-HZ; Manufacturer: TDK; Octopart URL: https://octopart.com/spm6530t-100m-hz-tdk-90326471; OctopartID: 8deb4183ed4a522c; Supplier: LCSC; Supplier Part Number: C360728
R31 = CMP-90ca5a8d69034f0d-5: as R16 on sheet Power_Supply_1; Package / Case: 1206; Resistance: 0.1; Resistance Tolerance: 1%; Supplier: LCSC; Supplier Part Number: C25334
R32 = CMP-1853278-23: Surface Mount Thick Film Resistor, RC Series, 1 kohm, 100 mW, - 1%, 50 V, 0603 [1608 Metric]; Manufacturer: UNI-ROYAL(Uniroyal Elec); Manufacture Part Number: 0603WAF1622T5E; Resistance Tolerance: 1%; Package / Case: 0603; Resistance: 16.2k; Supplier: LCSC; Supplier Part Number: C22885
R33 = CMP-1853278-23: Surface Mount Thick Film Resistor, RC Series, 1 kohm, 100 mW, - 1%, 50 V, 0603 [1608 Metric]; Manufacturer: UNI-ROYAL(Uniroyal Elec); Manufacture Part Number: 0603WAF1183T5E; Resistance Tolerance: 1%; Package / Case: 0603; Resistance: 118k; Supplier: LCSC; Supplier Part Number: C25806
R34 = CMP-1853278-27: as R19 on sheet Power_Supply_1; Resistance Tolerance: 1%; Supplier: LCSC; Supplier Part Number: C98220; Resistance: 10k; Package / Case: 0603
R35 = CMP-1853278-27: Surface Mount Thick Film Resistor, RC Series, 1 kohm, 100 mW, - 1%, 50 V, 0603 [1608 Metric]; Manufacture Part Number: RC0603FR-074K7L; Manufacturer: YAGEO; Package / Case: 0603; Resistance: 4.7k; Resistance Tolerance: 1%; Supplier: LCSC; Supplier Part Number: C99782
U9 = CMP-793bb472c98da6fc-1: Conv DC-DC 4.5V to 28V Synchronous Step Down Single-Out -0.1V to 28V 2A 6-Pin TSOT-23 T/R; Manufacturer: Texas Instruments; Manufacture Part Number: TPS54202DDCR; Supplier: LCSC; Supplier Part Number: C191884
VR3 = CMP-a8df61d7bf077718-3: as VR2 on sheet Power_Supply_2; Size-Height: 10.0 mm; Supplier Part Number: C118206; Supplier: LCSC; Resistance: 2k

## Sheet 24V_Boost.SchDoc
size A4
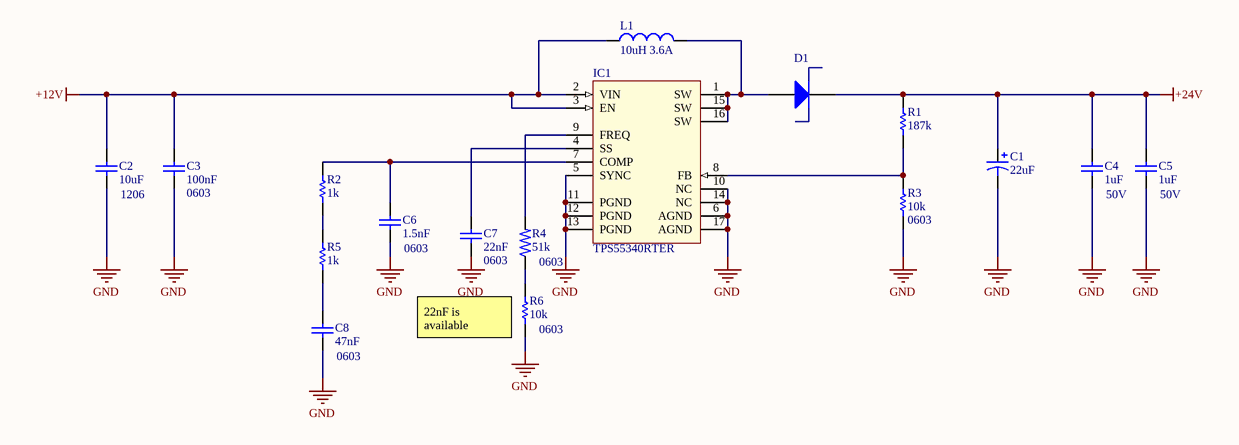
[diagram p5: 24V_Boost.SchDoc]

### Parts
C1  22uF  [PCB-jngp9cavmssoy37xiwaz-1]
C2  10uF  Package / Case: 1206  [CAPC3216X127X50ML20T25]
C3  100nF  Package / Case: 0603  [CAPC1608X09N]
C4  1uF  Voltage-Rated: 50V  [CAPC1608X09N]
C5  1uF  Voltage-Rated: 50V  [CAPC1608X09N]
C6  1.5nF  Package / Case: 0603  [CAPC1608X09N]
C7  22nF  Package / Case: 0603  [CAPC1608X09N]
C8  47nF  Package / Case: 0603  [CAPC1608X09N]
D1  (no value)  [PCB-z3532lqu4iri8rzc55ux-1]
IC1  TPS55340RTER  [VfQFPN 3x3x1.0 16L]
L1  10uH 3.6A  [PCB-aqghgth2fl3irtnr7nhi-1]
R1  187k  [gen0603-2]
R2  1k  [gen0603-2]
R3  10k  Package / Case: 0603  [gen0603-2]
R4  51k  Package / Case: 0603  [PCB-3elf45qdqizoabmczrxc-1]
R5  1k  [gen0603-2]
R6  10k  Package / Case: 0603  [gen0603-2]

### Nets
+12V: C2.2 C3.1 IC1.2(VIN) IC1.3(EN) L1.1
+24V: C1.1 C4.2 C5.2 D1.2(K) R1.2
GND: C1.2 C2.1 C3.2 C4.1 C5.1 C6.1 C7.1 C8.1 IC1.5(SYNC) IC1.6(AGND) IC1.10(NC) IC1.11(PGND) IC1.12(PGND) IC1.13(PGND) IC1.14(NC) IC1.17(AGND) R3.2 R6.1
NetC6_2: C6.2 IC1.7(COMP) R2.2
NetC7_2: C7.2 IC1.4(SS)
NetC8_2: C8.2 R5.2
NetD1_1: D1.1(A) IC1.1(SW) IC1.15(SW) IC1.16(SW) L1.2
NetIC1_8: IC1.8(FB) R1.1 R3.1
NetIC1_9: IC1.9(FREQ) R4.2
NetR2_1: R2.1 R5.1
NetR4_1: R4.1 R6.2

### Notes on the sheet
- (near R6) 22nF is available

### Library data of the parts
C1 = CMP-ceae0666f79b1169-1: Polymer capacitor [Panasonic Automotive & Industrial Systems] 35SVPF22M Polymer capacitor; Manufacture Part Number: OCV220M1VTR-0606; Manufacturer: Lelon; Voltage Rated: 35V; Size-Diameter: 6.30 mm; Supplier Part Number: C473426; Capacitance: 22uF; Supplier: LCSC
C2 = CMP-126371-4: as C35 on sheet Power_Supply_1; Supplier: LCSC; Capacitance: 10uF; Capacitance Tolerance: 10%; Supplier Part Number: C89632
C3 = CMP-2f55e5122ad9f092-5: as C42 on sheet Power_Card; Capacitance Tolerance: 10%; Capacitance: 100nF; Supplier: LCSC; Supplier Part Number: C14663
C4 C5 = CMP-2f55e5122ad9f092-5: as C40 on sheet Power_Card; Capacitance: 1uF; Package / Case: 0603; Supplier: LCSC; Supplier Part Number: C28323; Capacitance Tolerance: 10%
C6 = CMP-2f55e5122ad9f092-5: 0603 10 nF 50 V ± 10% Tolerance X7R Surface Mount Multilayer Ceramic Capacitor; Manufacture Part Number: 0603B152K500CT; Manufacturer: Walsin Tech Corp; Voltage-Rated: 50V; Capacitance Tolerance: 10%; Capacitance: 1.5nF; Supplier: LCSC; Supplier Part Number: C302015
C7 = CMP-2f55e5122ad9f092-5_11: 0603 10 nF 50 V ± 10% Tolerance X7R Surface Mount Multilayer Ceramic Capacitor; Manufacture Part Number: CL10B223KB8NNNC; Manufacturer: Samsung Electro-Mechanics; Voltage-Rated: 50V; Capacitance Tolerance: 10%; Capacitance: 22nF; Supplier: LCSC; Supplier Part Number: C21122
C8 = CMP-2f55e5122ad9f092-5: 0603 10 nF 50 V ± 10% Tolerance X7R Surface Mount Multilayer Ceramic Capacitor; Manufacture Part Number: 0603F473M500CT; Manufacturer: Walsin Tech Corp; Capacitance Tolerance: 20%; Voltage-Rated: 50V; Capacitance: 47nF; Supplier: LCSC; Supplier Part Number: C387994
D1 = CMP-d6251f2b0bb209e2-2: Diode, Schottky, 5a, 40v, Do-214ab-2, Full Reel; Manufacturer: Diodes Incorporated; Manufacture Part Number: B540C-13-F; Output Current: 5.00 A (max); Polarity: Standard; Capacitance: 300 pF; Voltage Rating (DC): 40.0 V; Lead-Free Status: Lead Free; Current Rating: 5.00 A; Supplier Part Number: C72264; Supplier: LCSC; OctopartID: d6251f2b0bb209e2; Number of Pins: 2; Octopart URL: http://octopart.com/b540c-13-f-diodes+inc.-325873; REACH SVHC Compliance: No SVHC; Mounting Style: Surface Mount
IC1 = TPS55340RTER: Integrated, 5-A 40-V Wide Input Range Boost/SEPIC/Flyback DC-DC Regulator 16-WQFN -40 to 150; Manufacturer: Texas Instruments; Manufacture Part Number: TPS55340RTER; Supplier Part Number: C169167; Supplier: LCSC
L1 = CMP-8deb4183ed4a522c-1: as L3 on sheet Power_Supply_3; Octopart URL: https://octopart.com/spm6530t-100m-hz-tdk-90326471; OctopartID: 8deb4183ed4a522c; Supplier: LCSC; Supplier Part Number: C360728
R1 = CMP-1853278-27: Surface Mount Thick Film Resistor, RC Series, 1 kohm, 100 mW, - 1%, 50 V, 0603 [1608 Metric]; Manufacturer: UNI-ROYAL(Uniroyal Elec); Manufacture Part Number: 0603WAF1873T5E; Resistance Tolerance: 1%; Supplier: LCSC; Supplier Part Number: C22896; Resistance: 187k; Package / Case: 0603
R2 R5 = CMP-1853278-27: Surface Mount Thick Film Resistor, RC Series, 1 kohm, 100 mW, - 1%, 50 V, 0603 [1608 Metric]; Manufacture Part Number: RC0603FR-071KL; Manufacturer: YAGEO; Package / Case: 0603; Resistance: 1k; Resistance Tolerance: 1%; Supplier: LCSC; Supplier Part Number: C22548
R3 R6 = CMP-1853278-27: as R19 on sheet Power_Supply_1; Resistance Tolerance: 1%; Supplier: LCSC; Supplier Part Number: C98220; Resistance: 10k
R4 = CMP-1853278-23: as R26 on sheet Power_Supply_2; Resistance Tolerance: 1%; Resistance: 51k; Supplier: LCSC; Supplier Part Number: C384211

## Sheet MCU.SchDoc
size A3
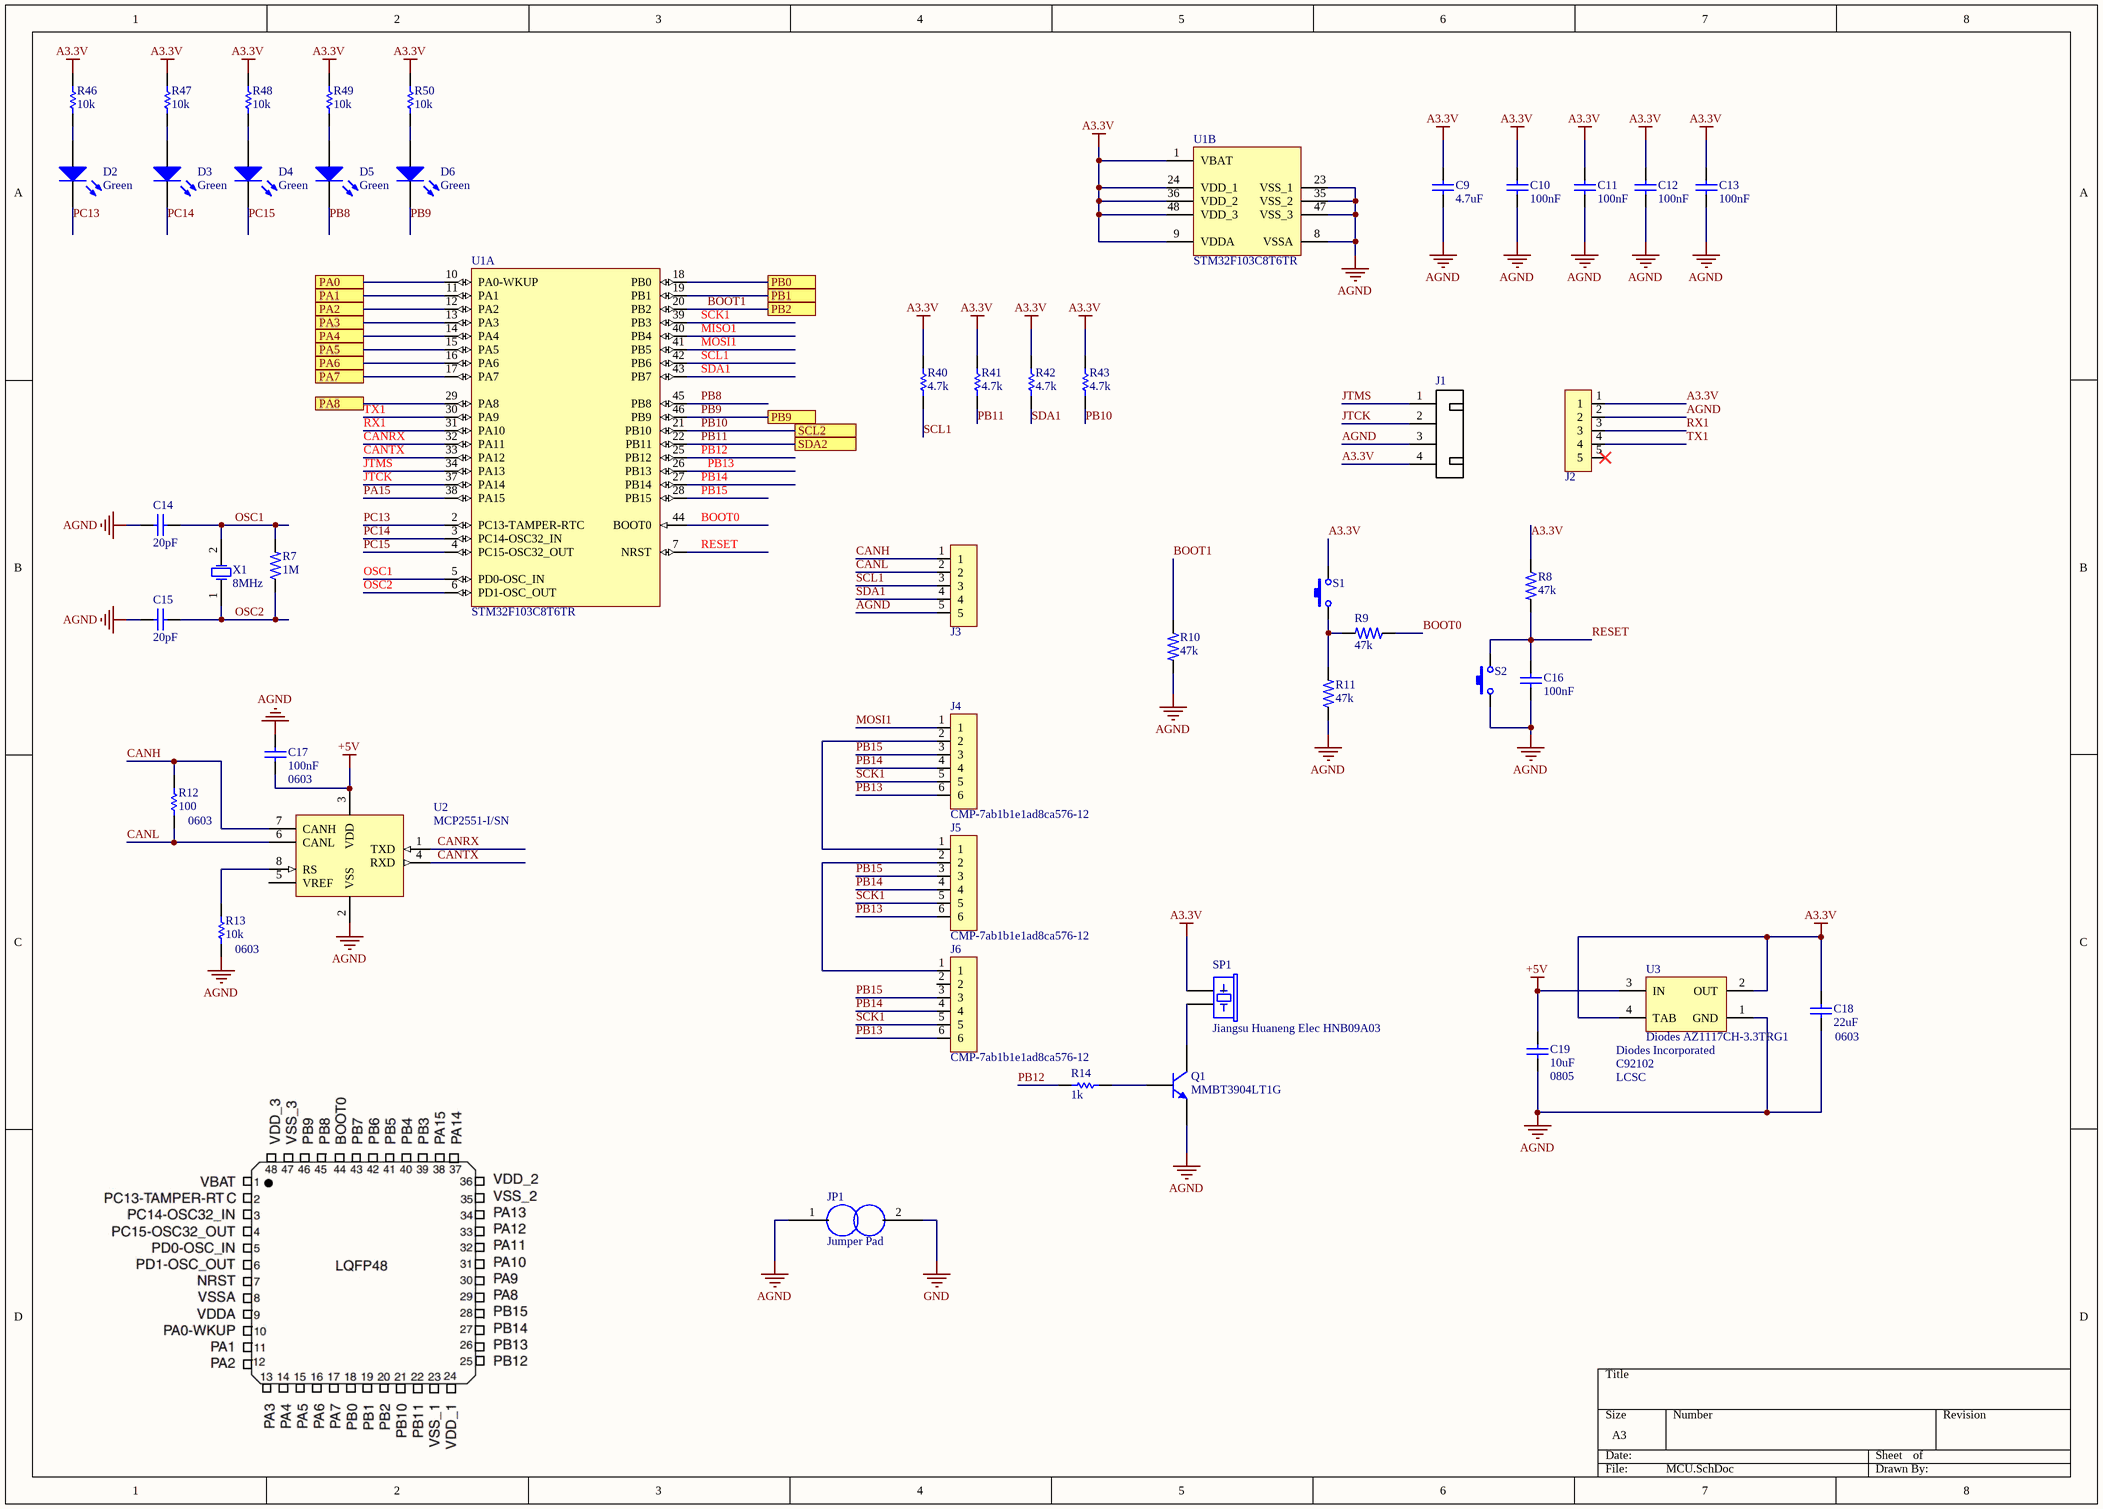
[diagram p6: MCU.SchDoc]

### Parts
C9  4.7uF  [CAPC1608X09N]
C10  100nF  [CAPC1608X09N]
C11  100nF  [CAPC1608X09N]
C12  100nF  [CAPC1608X09N]
C13  100nF  [CAPC1608X09N]
C14  20pF  [CAPC1608X09N]
C15  20pF  [CAPC1608X09N]
C16  100nF  [CAPC1608X09N]
C17  100nF  Package / Case: 0603  [CAPC1608X09N]
C18  22uF  Package / Case: 0603  [CAPC1608X09N]
C19  10uF  Package / Case: 0805  [C0805]
D2  Green  [PCBComponent_1 - duplicate]
D3  Green  [PCBComponent_1 - duplicate]
D4  Green  [PCBComponent_1 - duplicate]
D5  Green  [PCBComponent_1 - duplicate]
D6  Green  [PCBComponent_1 - duplicate]
J1  CMP-a6466f3bff057981-11  [PCB-z52whxwf67d3eu6gna8s-1]  (value not drawn)
J2  TE Connectivity / AMP 3-644456-5  [PCB-rnlen50cc5tt6vc22c1r-1]  (value not drawn)
J3  TE Connectivity / AMP 3-644456-5  [PCB-rnlen50cc5tt6vc22c1r-1]  (value not drawn)
J4  CMP-7ab1b1e1ad8ca576-12  [PCB-oudem42uhcimrbfznktg-1]
J5  CMP-7ab1b1e1ad8ca576-12  [PCB-oudem42uhcimrbfznktg-1]
J6  CMP-7ab1b1e1ad8ca576-12  [PCB-oudem42uhcimrbfznktg-1]
JP1  Jumper Pad  [PCB-sjva3kmaxrqfkswkvsp7-1]
Q1  MMBT3904LT1G  [SOT-23]
R7  1M  [PCB-3elf45qdqizoabmczrxc-1]
R8  47k  [PCB-3elf45qdqizoabmczrxc-1]
R9  47k  [PCB-3elf45qdqizoabmczrxc-1]
R10  47k  [PCB-3elf45qdqizoabmczrxc-1]
R11  47k  [PCB-3elf45qdqizoabmczrxc-1]
R12  100  Package / Case: 0603  [gen0603-2]
R13  10k  Package / Case: 0603  [gen0603-2]
R14  1k  [gen0603-2]
R40  4.7k  [gen0603-2]
R41  4.7k  [gen0603-2]
R42  4.7k  [gen0603-2]
R43  4.7k  [gen0603-2]
R46  10k  [gen0603-2]
R47  10k  [gen0603-2]
R48  10k  [gen0603-2]
R49  10k  [gen0603-2]
R50  10k  [gen0603-2]
S1  CMP-3c1bf499dccde3dc-3  [PCB-884bonwl6v4pb9lbnr4u-1]  (value not drawn)
S2  CMP-3c1bf499dccde3dc-3  [PCB-884bonwl6v4pb9lbnr4u-1]  (value not drawn)
SP1  Jiangsu Huaneng Elec HNB09A03  [PCB-gql0f0yk39bxcwo1gexj-1]
U1  STM32F103C8T6TR  [STM-LQFP48_M]  (parts A,B of 2)
U2  MCP2551-I/SN  [PCB-j27wim3vo61mdxz6aows-1]
U3  Diodes AZ1117CH-3.3TRG1  Manufacturer: Diodes Incorporated  Supplier Part Number: C92102  Supplier: LCSC  [PCB-15095235-1]
X1  8MHz  [XTAL1]

### Ports
PA0, PA1, PA2, PA3, PA4, PA5, PA6, PA7, PA8, PB0, PB1, PB2, PB9, SCL2, SDA2

### Nets
+5V: C17.2 C19.2 U2.3(VDD) U3.3(IN)
A3.3V: C9.2 C10.2 C11.2 C12.2 C13.2 C18.2 J1.4 J2.1 R8.1 R40.2 R41.2 R42.2 R43.2 R46.2 R47.2 R48.2 R49.2 R50.2 S1.2 SP1.1(+) U1.1(VBAT) U1.9(VDDA) U1.24(VDD_1) U1.36(VDD_2) U1.48(VDD_3) U3.2(OUT) U3.4(TAB)
AGND: C9.1 C10.1 C11.1 C12.1 C13.1 C14.2 C15.2 C16.1 C17.1 C18.1 C19.1 J1.3 J2.2 J3.5 JP1.1 Q1.2(E) R10.2 R11.1 R13.1 S2.1 U1.8(VSSA) U1.23(VSS_1) U1.35(VSS_2) U1.47(VSS_3) U2.2(VSS) U3.1(GND)
GND: JP1.2
BOOT0: R9.1 U1.44(BOOT0)
BOOT1: R10.1 U1.20(PB2) ; port PB2
CANH: J3.1 R12.2 U2.7(CANH)
CANL: J3.2 R12.1 U2.6(CANL)
CANRX: U1.32(PA11) U2.1(TXD)
CANTX: U1.33(PA12) U2.4(RXD)
EN_1: U1.10(PA0-WKUP) ; port PA0
EN_2: U1.14(PA4) ; port PA4
EN_3: U1.18(PB0) ; port PB0
ILIM_FB_1: U1.11(PA1) ; port PA1
ILIM_FB_2: U1.12(PA2) ; port PA2
ILIM_FB_3: U1.19(PB1) ; port PB1
JTCK: J1.2 U1.37(PA14)
JTMS: J1.1 U1.34(PA13)
LDAC_1: U1.13(PA3) ; port PA3
MISO1: U1.40(PB4)
MOSI1: J4.1 U1.41(PB5)
OSC1: C14.1 R7.2 U1.5(PD0-OSC_IN) X1.2(X2)
OSC2: C15.1 R7.1 U1.6(PD1-OSC_OUT) X1.1(X1)
PA15: U1.38(PA15)
PB8: D5.2(K) U1.45(PB8)
PB9: D6.2(K) U1.46(PB9) ; port PB9
PB10: R43.1 U1.21(PB10) ; port SCL2
PB11: R41.1 U1.22(PB11) ; port SDA2
PB12: R14.2 U1.25(PB12)
PB13: J4.6 J5.6 J6.6 U1.26(PB13)
PB14: J4.4 J5.4 J6.4 U1.27(PB14)
PB15: J4.3 J5.3 J6.3 U1.28(PB15)
PC13: D2.2(K) U1.2(PC13-TAMPER-RTC)
PC14: D3.2(K) U1.3(PC14-OSC32_IN)
PC15: D4.2(K) U1.4(PC15-OSC32_OUT)
RELAY_1: U1.17(PA7) ; port PA7
RELAY_2: U1.16(PA6) ; port PA6
RELAY_3: U1.15(PA5) ; port PA5
RESET: C16.2 R8.2 S2.2 U1.7(NRST)
RX1: J2.3 U1.31(PA10)
SCK1: J4.5 J5.5 J6.5 U1.39(PB3)
SCL1: J3.3 R40.1 U1.42(PB6)
SDA1: J3.4 R42.1 U1.43(PB7)
TX1: J2.4 U1.30(PA9)
NetD2_1: D2.1(A) R46.1
NetD3_1: D3.1(A) R47.1
NetD4_1: D4.1(A) R48.1
NetD5_1: D5.1(A) R49.1
NetD6_1: D6.1(A) R50.1
NetJ4_2: J4.2 J5.1
NetJ5_2: J5.2 J6.1
NetQ1_1: Q1.1(B) R14.1
NetQ1_3: Q1.3(C) SP1.2(-)
NetR9_2: R9.2 R11.2 S1.1
NetR13_2: R13.2 U2.8(RS)
NetU1_29: U1.29(PA8) ; port PA8

Not connected (* = marked no-connect by the designer): J2 5*; J6 2; U2 5(VREF)

### Library data of the parts
C9 = CMP-2f55e5122ad9f092-5: 0603 10 nF 50 V ± 10% Tolerance X7R Surface Mount Multilayer Ceramic Capacitor; Manufacture Part Number: CL10A475KP8NNNC; Manufacturer: Samsung Electro-Mechanics; Voltage-Rated: 10V; Capacitance: 4.7uF; Package / Case: 0603; Supplier: LCSC; Supplier Part Number: C1705; Capacitance Tolerance: 10%
C10-C13 C16 C17 = CMP-2f55e5122ad9f092-5: as C42 on sheet Power_Card; Capacitance Tolerance: 10%; Capacitance: 100nF; Supplier: LCSC; Supplier Part Number: C14663
  C10-C13 C16: Package / Case: 0603
C14 C15 = CMP-2f55e5122ad9f092-5: 0603 10 nF 50 V ± 10% Tolerance X7R Surface Mount Multilayer Ceramic Capacitor; Manufacture Part Number: CC0603JRNPO9BN200; Manufacturer: YAGEO; Voltage-Rated: 50V; Capacitance Tolerance: 5%; Capacitance: 20pF; Package / Case: 0603; Supplier: LCSC; Supplier Part Number: C105621
C18 = CMP-2f55e5122ad9f092-5: as C24 on sheet Power_Supply_2; Capacitance: 22uF; Supplier: LCSC; Supplier Part Number: C86295
C19 = CMP-135114-3: as C22 on sheet Power_Supply_2; Capacitance Tolerance: *; Capacitance: 10uF; Supplier: LCSC; Supplier Part Number: C95841
D2-D6 = CMP-7ejgl1mi36gtz3spabtw-1: Generic LED 0603; Manufacturer: Orient; Manufacture Part Number: ORH-G36G; Forward Voltage: 2.8V; Color: Green; Supplier: LCSC; Supplier Part Number: C205443
J1 = CMP-a6466f3bff057981-11: XH Series 4 Position 2.5 mm Pitch Through Hole Crimp Top Entry Shrouded Header; Manufacture Part Number: B4B-XH-A (LF)(SN); Manufacturer: JST Sales America; Gender: Male; Voltage Rating (AC): 250 V; Current Rating: 3.00 A; Lead-Free Status: Lead Free; Contact Resistance: 10.0 mΩ; Company: JST; Insulation Resistance: 1.00 GΩ; Number of Contacts: 4; Contact Material: Brass; Contact Plating: Tin; Octopart URL: http://octopart.com/b4b-xh-a+%28lf%29%28sn%29-jst-7830565; Mounting Style: Through Hole, Vertical; RoHS: Compliant; OctopartID: a6466f3bff057981; REACH SVHC Compliance: No SVHC; Supplier Part Number: C144395; Supplier: LCSC
J2 J3 = CMP-b5d67e8662e76a11-19: MTA-100 5 Position Through-Hole Single Row Straight Wire to Board Header; Number of Positions: 5; Lead-Free Status: Lead Free; ELV Compliant: Compliant; Mounting Angle: 180 °; Shrouded: No; Gender: Male; Pin Pitch: 2.54 mm; Voltage Rating (AC): 250 V; Housing Color: Natural; Orientation: Vertical; Flammability Rating: UL 94 V-0; Lifecycle Status: Active; RoHS: Compliant; Contact Material: Copper Alloy; Mounting Style: Through Hole; Housing Material: Polyester; Packaging: Box, Bag; Contact Plating: Tin; Size-Length: 12.4 mm; Number of Rows: 1; OctopartID: b5d67e8662e76a11; Octopart URL: http://octopart.com/3-644456-5-te+connectivity+%2F+amp-39514711; Number of Contacts: 5; Size-Height: 2.54 mm; Size-Width: 2.34 mm
J4-J6 = CMP-7ab1b1e1ad8ca576-12: MTA-100 Series 6 Position 2.54 mm Pitch Single Row Tin Plated Header; Size-Height: 2.54 mm
JP1 = CMP-75tq5o8j4p0avfd6ylbk-1: JP; CustomComponentID: 75tq5o8j4p0avfd6ylbk
Q1 = CMP-857799-8: as Q4 on sheet Power_Supply_Current_Limit; Supplier Part Number: C81464; Supplier: LCSC; Manufacture Part Number: MMBT3904LT1G
R7 = CMP-1853278-23: Surface Mount Thick Film Resistor, RC Series, 1 kohm, 100 mW, - 1%, 50 V, 0603 [1608 Metric]; Manufacturer: UNI-ROYAL(Uniroyal Elec); Manufacture Part Number: 0603WAF1004T5E; Resistance Tolerance: 1%; Resistance: 1M; Supplier: LCSC; Supplier Part Number: C22935; Package / Case: 0603
R8-R11 = CMP-1853278-23: Surface Mount Thick Film Resistor, RC Series, 1 kohm, 100 mW, - 1%, 50 V, 0603 [1608 Metric]; Manufacturer: UNI-ROYAL(Uniroyal Elec); Manufacture Part Number: 0603WAF4702T5E; Resistance Tolerance: 1%; Resistance: 47k; Supplier: LCSC; Supplier Part Number: C25819; Package / Case: 0603
R12 = CMP-1853278-27: as R44 on sheet Power_Card; Resistance Tolerance: 1%; Supplier: LCSC; Supplier Part Number: C22775; Resistance: 100
R13 R46-R50 = CMP-1853278-27: as R19 on sheet Power_Supply_1; Resistance Tolerance: 1%; Supplier: LCSC; Supplier Part Number: C98220; Resistance: 10k
  R46-R50: Package / Case: 0603
R14 = CMP-1853278-27_16: as R15 on sheet Power_Card; Resistance Tolerance: 1%; Supplier: LCSC; Supplier Part Number: C22548; Resistance: 1k; Package / Case: 0603
R40-R43 = CMP-1853278-27: as R35 on sheet Power_Supply_3; Package / Case: 0603; Resistance: 4.7k; Resistance Tolerance: 1%; Supplier: LCSC; Supplier Part Number: C99782
S1 S2 = CMP-3c1bf499dccde3dc-3: Switch Tactile N.O. SPST Rectangular Button Gull Wing 0.05A 12VDC 2.45N SMD; Manufacture Part Number: K2-1107ST-A4SW-06; Manufacturer: Korean Hroparts Elec; Lead-Free Status: Lead Free; RoHS: Compliant; Supplier Part Number: C118141; Supplier: LCSC
SP1 = CMP-8r7wb9d4hsrx0vdasxxy-1: Magnetic YES 3000±300Hz 90dB @ 3V, 10cm 3V ?9mm 9*5.5mm Buzzers RoHS; Manufacturer: Jiangsu Huaneng Elec; CustomComponentID: 8r7wb9d4hsrx0vdasxxy; Manufacture Part Number: HNB09A03; Supplier Part Number: C96102; Supplier: LCSC
U1 = CMP-2954476-4: ARM Cortex-M3 32-bit MCU, 64 KB Flash, 20 KB Internal RAM, 37 I/Os, 48-pin LQFP, -40 to 85 degC, Tape and Reel; Manufacturer: STMicroelectronics; Lead-Free Status: Lead Free; Lifecycle Status: Active; Octopart Url: https://octopart.com/stm32f103c8t6tr-stmicroelectronics-11955474; OctopartID: c3c10a7d8bb51c06; RoHS: Compliant; Manufacture Part Number: STM32F103C8T6; Supplier Part Number: C8734; Supplier: LCSC
U2 = MCP2551-I/SN: Microchip MCP2551-I/SN; CAN Transceiver1Mbit/s 1-channel ISO 11898; 8-Pin SOIC; Manufacturer: Microchip Tech; Supply Current: 75.0 mA; Supply Voltage (DC): 4.50 V (min), 5.50 V (max); Slew Rate: 8.50 V/μs; Data Rate: 1.00 Mbps; Lead-Free Status: Lead Free; Packaging: Tube; Octopart URL: https://octopart.com/mcp2551-i%2Fsn-microchip-99155; REACH SVHC Compliance: No SVHC; Number of Pins: 8; Octopart ID: 0bb6c2bdad83d471; OctopartID: 0bb6c2bdad83d471; Manufacture Part Number: MCP2551-I/SN; Supplier: LCSC; Supplier Part Number: C7376
U3 = CMP-15095235-4: IC REG LDO 3.3V 0.8A SOT223; Lead-Free Status: Lead Free; OctopartID: a6d46e06d6807913; Octopart Url: https://octopart.com/az1117ch-3.3trg1-diodes+inc.-30954802; Lifecycle Status: Not Listed by Manufacturer; RoHS: Compliant; Manufacture Part Number: AZ1117CH-3.3TRG1
X1 = CMP-4bca809c9193940d-1: Microprocessor, Crystal; 8 MHz; 30 ppm (Typ.) @ degC; 7 pF (Max.); 20 pF; Manufacturer: Yangxing Tech; Manufacture Part Number: X49SD8MSD2SC; Equivalent Series Resistance (ESR): 80.0 Ω; OctopartID: 4bca809c9193940d; Packaging: Bulk; Octopart Url: http://octopart.com/xt9s20ana8m-vishay+dale-39649087; Seller Landing  Url: https://octopart-clicks.com/click/track?country=US&ak=8157f166&sig=0e2aaf1&sid=2402&ppid=39649087&vpid=249355928&ct=offers; Mounting Style: Through Hole; Number of Pins: 2; Supplier: LCSC; Supplier Part Number: C21263

## Nets that join several sheets
+5V: Power_Card (J12.1), PS1/L1 (C32_L1.2 IC3_L1.8 Q3_L1.5), PS2/L2 (C32_L2.2 IC3_L2.8 Q3_L2.5), PS3/L3 (C32_L3.2 IC3_L3.8 Q3_L3.5), MCU (C17.2 C19.2 U2.3 U3.3)
+12V: Power_Card (J12.2 R15.2 U7.5), Power_Supply_1 (5 pins), Power_Supply_2 (C22.2 C23.2 IC2.8 K2.4), Power_Supply_3 (K3.4), 24V_Boost (5 pins)
+24V: Power_Card (5 pins), Power_Supply_3 (C30.2 C31.2 U9.3), 24V_Boost (5 pins)
-12V: Power_Card (C40.2 J11.2 U10.3), Power_Supply_1 (6 pins)
AGND: Power_Card (7 pins), MCU (26 pins)
GND: Power_Card (5 pins), Power_Supply_1 (7 pins), PS1/L1 (8 pins), Power_Supply_2 (9 pins), PS2/L2 (8 pins), Power_Supply_3 (6 pins), PS3/L3 (8 pins), 24V_Boost (18 pins), MCU (JP1.2)
BOOT1: Power_Card (U6.4), MCU (R10.1 U1.20)
EN_1: Power_Supply_1 (R17.2), MCU (U1.10)
EN_2: Power_Supply_2 (IC2.1 R27.1), MCU (U1.14)
EN_3: Power_Supply_3 (R34.1 U9.5), MCU (U1.18)
FB1: Power_Card (IC4.1 IC4.2), Power_Supply_1 (K1.2 VR1.2)
FB2: Power_Card (IC4.6 IC4.7), Power_Supply_2 (K2.3 VR2.2)
FB3: Power_Card (IC5.1 IC5.2), Power_Supply_3 (K3.2 VR3.2)
ILIM_FB_1: PS1/L1 (Q5_L1.3), MCU (U1.11)
ILIM_FB_2: PS2/L2 (Q5_L2.3), MCU (U1.12)
ILIM_FB_3: PS3/L3 (Q5_L3.3), MCU (U1.19)
ISET_1: Power_Card (TP1.1 U4.6), PS1/L1 (IC3_L1.2)
ISET_2: Power_Card (TP3.1 U4.8), PS2/L2 (IC3_L2.2)
ISET_3: Power_Card (TP5.1 U6.7), PS3/L3 (IC3_L3.2)
LDAC_1: Power_Card (U4.4), MCU (U1.13)
NetC21_1: Power_Supply_2 (5 pins), PS2/L2 (C33_L2.2 R36_L2.2)
NetC21_2: Power_Supply_2 (9 pins), PS2/L2 (Q3_L2.3)
NetC28_2: Power_Supply_3 (C28.2 C29.2 L3.2 R31.2), PS3/L3 (Q3_L3.3)
NetC29_1: Power_Supply_3 (5 pins), PS3/L3 (C33_L3.2 R36_L3.2)
NetC33_L1_2: Power_Supply_1 (R18.1 R19.2 U8.2), PS1/L1 (C33_L1.2 R36_L1.2)
NetQ3_L1_3: Power_Supply_1 (R16.2 U8.6), PS1/L1 (Q3_L1.3)
PB10: Power_Card (J10.1 U4.2 U6.2), MCU (R43.1 U1.21)
PB11: Power_Card (J10.2 U4.3 U6.3), MCU (R41.1 U1.22)
RELAY_1: Power_Card (U7.1), MCU (U1.17)
RELAY_2: Power_Card (U7.2), MCU (U1.16)
RELAY_3: Power_Card (U7.3), MCU (U1.15)
SW_VOUT_1: Power_Card (U7.6), Power_Supply_1 (K1.1)
SW_VOUT_2: Power_Card (U7.7), Power_Supply_2 (K2.1)
SW_VOUT_3: Power_Card (U7.8), Power_Supply_3 (K3.1)
VOUT1: Power_Card (J7.1 J7.2), Power_Supply_1 (K1.3 R16.1), PS1/L1 (Q3_L1.4)
VOUT2: Power_Card (J8.1 J8.2), Power_Supply_2 (6 pins), PS2/L2 (Q3_L2.4)
VOUT3: Power_Card (J9.1 J9.2), Power_Supply_3 (K3.3 R31.1), PS3/L3 (Q3_L3.4)
VSET_1: Power_Card (TP2.1 U4.7), Power_Supply_1 (U8.1)
VSET_2: Power_Card (TP4.1 U4.9), Power_Supply_2 (R28.1)
VSET_3: Power_Card (TP6.1 U6.6), Power_Supply_3 (R32.2)